# EAGLE schematic mainboard-revb (EAGLE 9.6.2)

## Sheet 1 of 11: USB-C Contains input power port and PHY
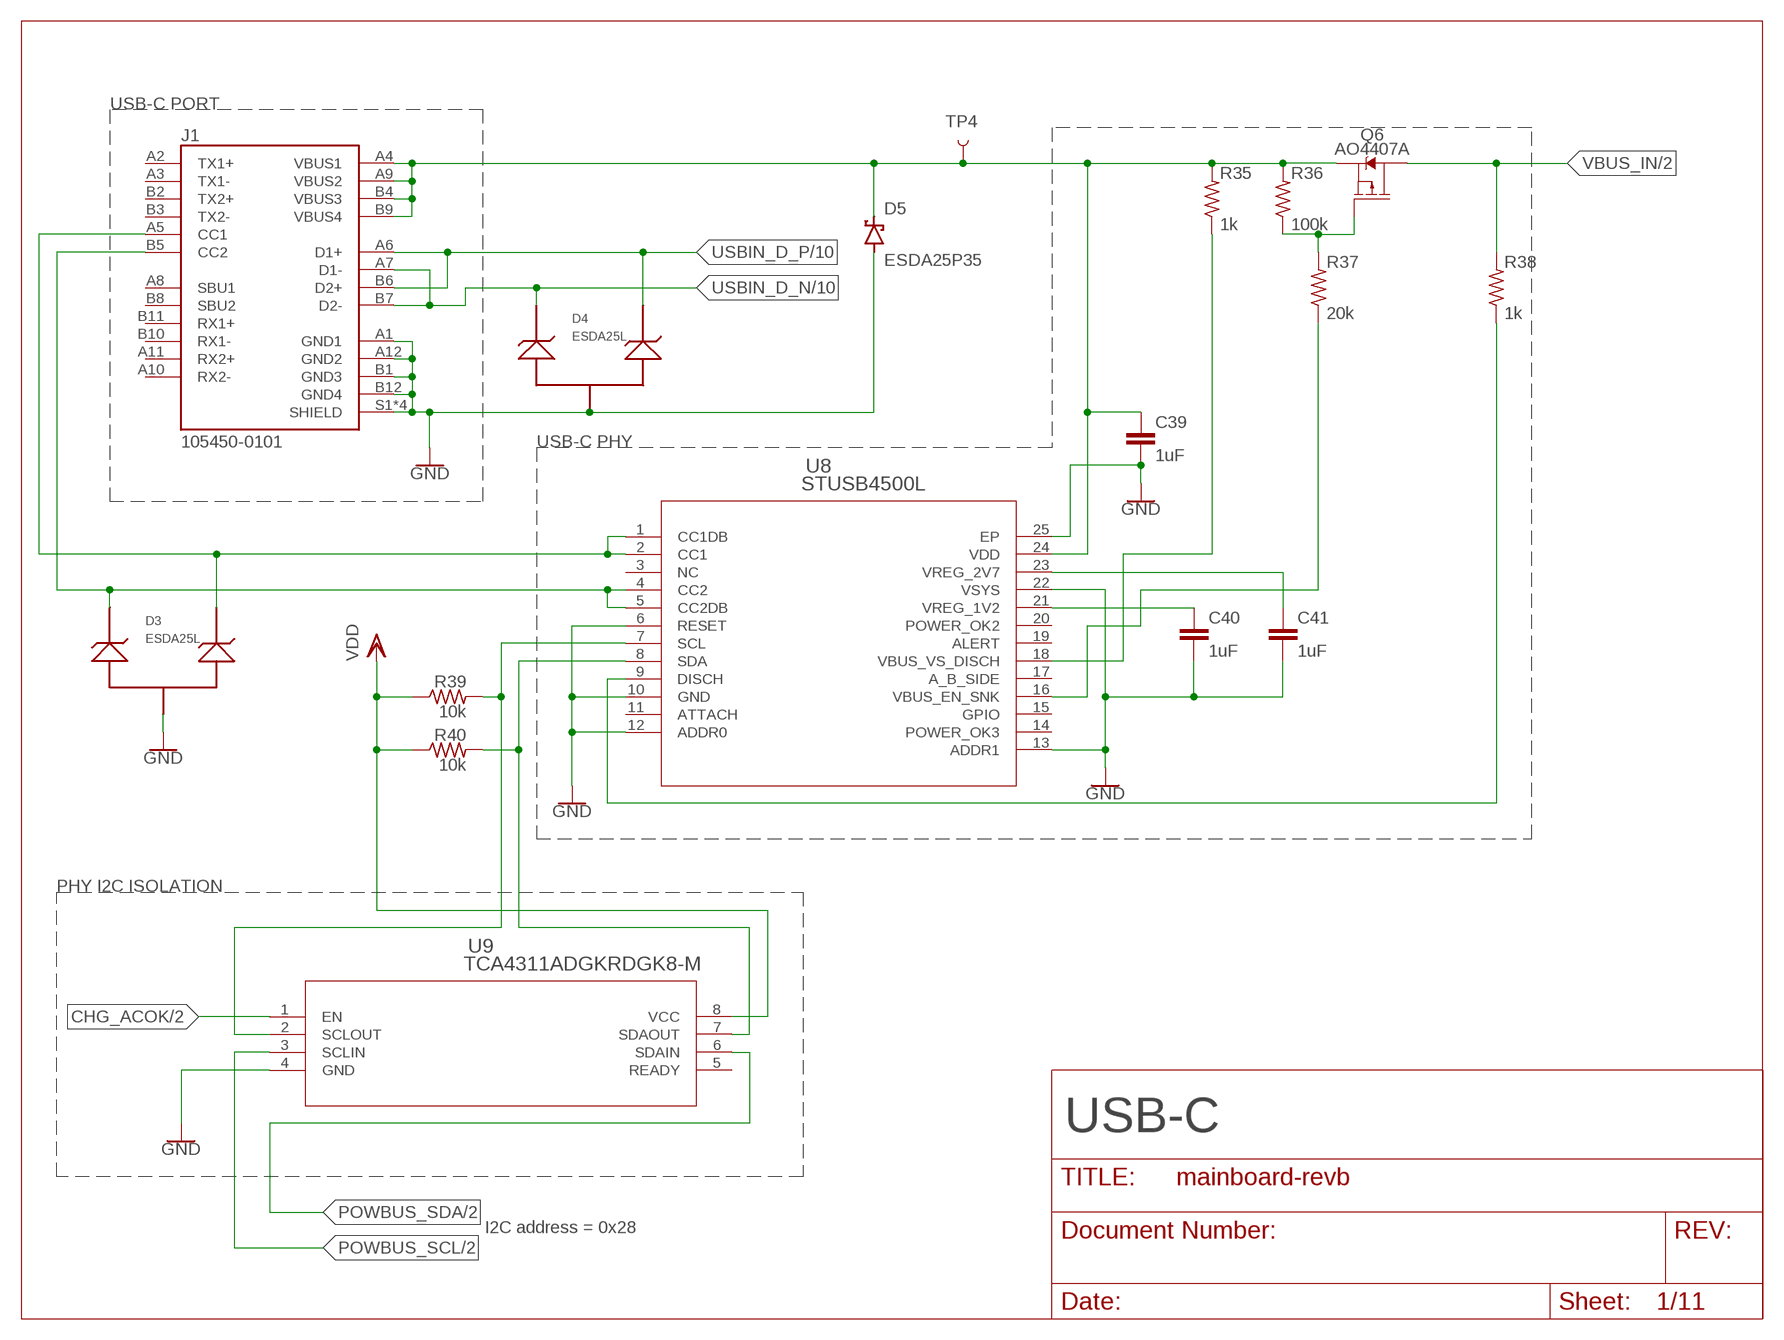
[diagram p0: schematic, sheet 1]

### Parts
C39  1uF  C-EUC0805  [C0805]
C40  1uF  C-EUC0805  [C0805]
C41  1uF  C-EUC0805  [C0805]
D3  ESDA25L  ESDAL  [SOT85P255X140-3L]
D4  ESDA25L  ESDAL  [SOT85P255X140-3L]
D5  ESDA25P35  SMF5.0AT1  [SOD123FL]
J1  105450-0101  [MOLEX_105450-0101]
Q6  AO4407A  [SOIC8]
R35  1k  R-US_R0402  [R0402]
R36  100k  R-US_R0402  [R0402]
R37  20k  R-US_R0402  [R0402]
R38  1k  R-US_R0402  [R0402]
R39  10k  R-US_R0402  [R0402]
R40  10k  R-US_R0402  [R0402]
TP4  TEST-POINT3X4  [PAD.03X.04]
U8  STUSB4500L  STUSB4500QTRQFN24EP_4X4_STM-M  [QFN24EP_4X4_STM-M]
U9  TCA4311ADGKRDGK8-M  [DGK8-M]

### Nets
CHG_ACOK: U9.1(EN) ; also sheet 2,10
GND: C39.2 C40.2 C41.2 D3.3 D4.3 D5.A J1.A1(GND1) J1.A12(GND2) J1.B1(GND3) J1.B12(GND4) J1.S1(SHIELD) J1.S2(SHIELD) J1.S3(SHIELD) J1.S4(SHIELD) U8.6(RESET) U8.10(GND) U8.12(ADDR0) U8.13(ADDR1) U8.22(VSYS) U8.25(EP) U9.4(GND) ; also sheet 2,3,4,6,7,8,9,10,11
N$27: C40.1 U8.21(VREG_1V2)
N$28: C41.1 U8.23(VREG_2V7)
N$32: C39.1 D5.C J1.A4(VBUS1) J1.A9(VBUS2) J1.B4(VBUS3) J1.B9(VBUS4) Q6.1(S) Q6.2(S) Q6.3(S) R35.2 R36.2 TP4.P$1 U8.24(VDD)
N$33: R35.1 U8.18(VBUS_VS_DISCH)
N$34: R37.1 U8.16(VBUS_EN_SNK)
N$35: Q6.4(G) R36.1 R37.2
N$37: R38.1 U8.9(DISCH)
N$38: R39.2 U8.7(SCL) U9.2(SCLOUT)
N$39: R40.2 U8.8(SDA) U9.7(SDAOUT)
POWBUS_SCL: U9.3(SCLIN) ; also sheet 2,3,9,10
POWBUS_SDA: U9.6(SDAIN) ; also sheet 2,3,9,10
USBIN_CC1: D3.2 J1.A5(CC1) U8.1(CC1DB) U8.2(CC1)
USBIN_CC2: D3.1 J1.B5(CC2) U8.4(CC2) U8.5(CC2DB)
USBIN_D_N: D4.1 J1.A7(D1-) J1.B7(D2-) ; also sheet 10
USBIN_D_P: D4.2 J1.A6(D1+) J1.B6(D2+) ; also sheet 10
VBUS_IN: Q6.5(D) Q6.6(D) Q6.7(D) Q6.8(D) R38.2 ; also sheet 2
VDD: R39.1 R40.1 U9.8(VCC) ; also sheet 2,3,4,5,6,7,8,9,10,11
Unconnected: J1.A2(TX1+) J1.A3(TX1-) J1.A8(SBU1) J1.A10(RX2-) J1.A11(RX2+) J1.B2(TX2+) J1.B3(TX2-) J1.B8(SBU2) J1.B10(RX1-) J1.B11(RX1+) U8.3(NC) U8.11(ATTACH) U8.14(POWER_OK3) U8.15(GPIO) U8.17(A_B_SIDE) U8.19(ALERT) U8.20(POWER_OK2) U9.5(READY)

### Notes on the sheet
- USB-C PORT
- USB-C PHY
- PHY I2C ISOLATION
- USB-C
- I2C address = 0x28

## Sheet 2 of 11: Battery Management (1/2) Contains the battery charger
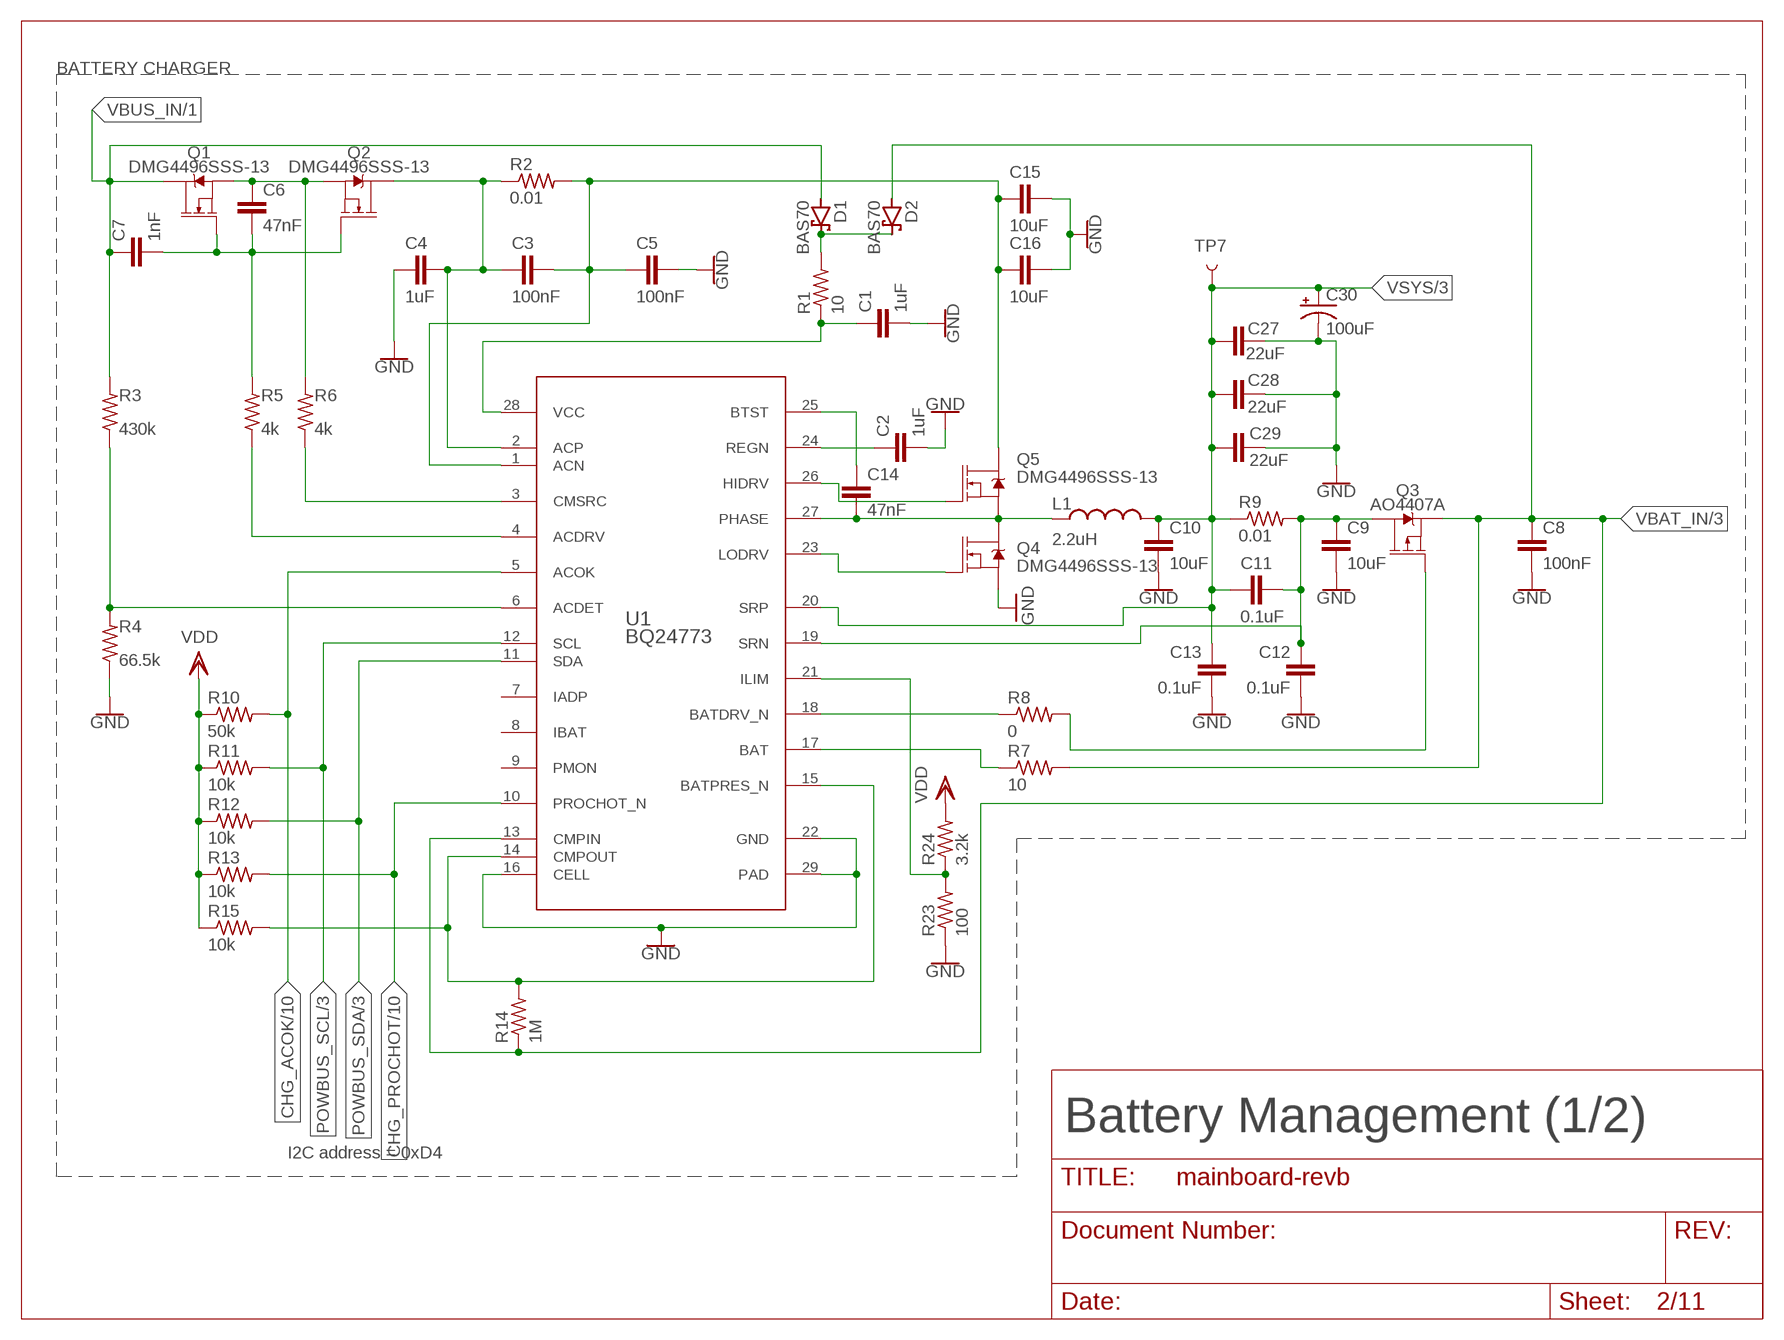
[diagram p1: schematic, sheet 2]

### Parts
C1  1uF  C-EUC0402  [C0402]
C2  1uF  C-EUC0402  [C0402]
C3  100nF  C-EUC0402  [C0402]
C4  1uF  C-EUC0402  [C0402]
C5  100nF  C-EUC0402  [C0402]
C6  47nF  C-EUC0402  [C0402]
C7  1nF  C-EUC0402  [C0402]
C8  100nF  C-EUC0402  [C0402]
C9  10uF  C-EUC0402  [C0402]
C10  10uF  C-EUC0402  [C0402]
C11  0.1uF  C-EUC0402  [C0402]
C12  0.1uF  C-EUC0402  [C0402]
C13  0.1uF  C-EUC0402  [C0402]
C14  47nF  C-EUC0402  [C0402]
C15  10uF  C-EUC0402  [C0402]
C16  10uF  C-EUC0402  [C0402]
C27  22uF  C-EUC0402  [C0402]
C28  22uF  C-EUC0402  [C0402]
C29  22uF  C-EUC0402  [C0402]
C30  100uF  CPOL-USC/6032-28R  [C/6032-28R]
D1  BAS70  [SOT23]
D2  BAS70  [SOT23]
L1  2.2uH  SPM6530T-2R2M  [INDPM7165X300N]
Q1  DMG4496SSS-13  [SOIC8]
Q2  DMG4496SSS-13  [SOIC8]
Q3  AO4407A  [SOIC8]
Q4  DMG4496SSS-13  [SOIC8]
Q5  DMG4496SSS-13  [SOIC8]
R1  10  R-US_R0402  [R0402]
R2  0.01  R-US_R0402  [R0402]
R3  430k  R-US_R0402  [R0402]
R4  66.5k  R-US_R0402  [R0402]
R5  4k  R-US_R0402  [R0402]
R6  4k  R-US_R0402  [R0402]
R7  10  R-US_R0402  [R0402]
R8  0  R-US_R0402  [R0402]
R9  0.01  R-US_R0402  [R0402]
R10  50k  R-US_R0402  [R0402]
R11  10k  R-US_R0402  [R0402]
R12  10k  R-US_R0402  [R0402]
R13  10k  R-US_R0402  [R0402]
R14  1M  R-US_R0402  [R0402]
R15  10k  R-US_R0402  [R0402]
R23  100  R-US_R0402  [R0402]
R24  3.2k  R-US_R0402  [R0402]
TP7  TEST-POINT3X4  [PAD.03X.04]
U1  Value  BQ24773RUYR  [RUY0028A]

### Nets
CHG_ACOK: R10.2 U1.5(ACOK) ; also sheet 1,10
CHG_PROCHOT: R13.2 U1.10(PROCHOT_N) ; also sheet 10
GND: C1.2 C2.2 C4.1 C5.2 C8.2 C9.2 C10.2 C12.1 C13.1 C15.1 C16.1 C27.1 C28.1 C29.1 C30.- Q4.1(S) Q4.2(S) Q4.3(S) R4.1 R23.1 U1.16(CELL) U1.22(GND) U1.29(PAD) ; also sheet 1,3,4,6,7,8,9,10,11
N$1: C3.1 C4.2 Q2.5(D) Q2.6(D) Q2.7(D) Q2.8(D) R2.1 U1.2(ACP)
N$2: C3.2 C5.1 C15.2 C16.2 Q5.5(D) Q5.6(D) Q5.7(D) Q5.8(D) R2.2 U1.1(ACN)
N$3: R7.1 U1.17(BAT)
N$4: D1.3(C) D2.3(C) R1.2
N$5: C6.1 Q1.1(S) Q1.2(S) Q1.3(S) Q2.1(S) Q2.2(S) Q2.3(S) R6.2
N$6: R6.1 U1.3(CMSRC)
N$7: R5.1 U1.4(ACDRV)
N$8: R3.1 R4.2 U1.6(ACDET)
N$9: C6.2 C7.2 Q1.4(G) Q2.4(G) R5.2
N$10: C1.1 R1.1 U1.28(VCC)
N$11: Q3.4(G) R8.2
N$12: R8.1 U1.18(BATDRV_N)
N$13: C9.1 C11.2 C12.2 Q3.5(D) Q3.6(D) Q3.7(D) Q3.8(D) R9.2 U1.19(SRN)
N$14: C2.1 U1.24(REGN)
N$15: C14.2 U1.25(BTST)
N$16: C14.1 L1.1 Q4.5(D) Q4.6(D) Q4.7(D) Q4.8(D) Q5.1(S) Q5.2(S) Q5.3(S) U1.27(PHASE)
N$17: Q4.4(G) U1.23(LODRV)
N$18: Q5.4(G) U1.26(HIDRV)
N$20: R14.2 R15.2 U1.14(CMPOUT) U1.15(BATPRES_N)
N$31: R23.2 R24.1 U1.21(ILIM)
POWBUS_SCL: R11.2 U1.12(SCL) ; also sheet 1,3,9,10
POWBUS_SDA: R12.2 U1.11(SDA) ; also sheet 1,3,9,10
VBAT_IN: C8.1 D2.1(A) Q3.1(S) Q3.2(S) Q3.3(S) R7.2 R14.1 U1.13(CMPIN) ; also sheet 3
VBUS_IN: C7.1 D1.1(A) Q1.5(D) Q1.6(D) Q1.7(D) Q1.8(D) R3.2 ; also sheet 1
VDD: R10.1 R11.1 R12.1 R13.1 R15.1 R24.2 ; also sheet 1,3,4,5,6,7,8,9,10,11
VSYS: C10.1 C11.1 C13.2 C27.2 C28.2 C29.2 C30.+ L1.2 R9.1 TP7.P$1 U1.20(SRP) ; also sheet 3,4
Unconnected: U1.7(IADP) U1.8(IBAT) U1.9(PMON)

### Notes on the sheet
- BATTERY CHARGER
- Battery Management (1/2)
- I2C address = 0xD4

## Sheet 3 of 11: Battery Management (2/2) Contains the battery gauge and connector NOTE: the calibration info is provided for reference only and is in no way present on the pcb
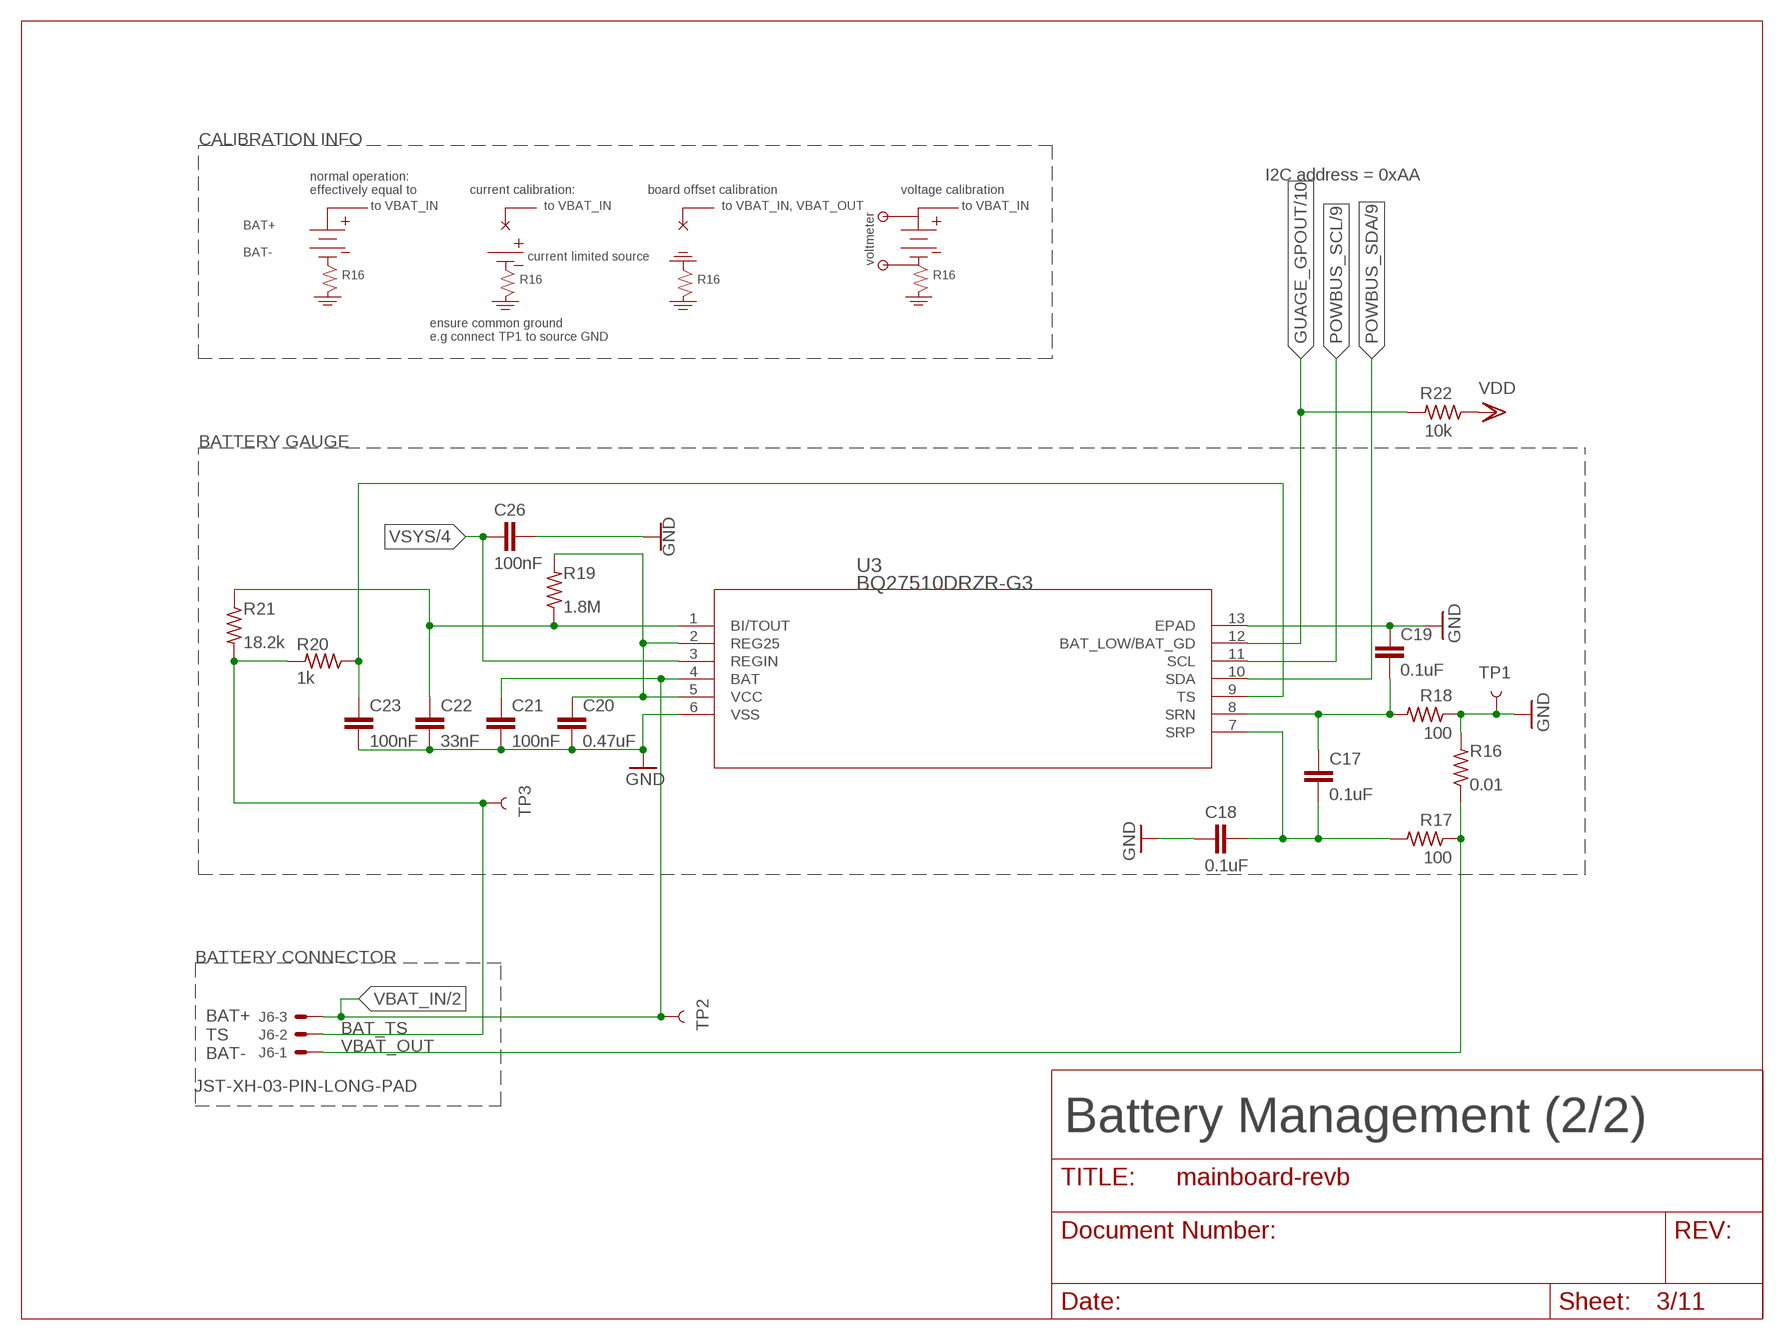
[diagram p2: schematic, sheet 3]

### Parts
C17  0.1uF  C-EUC0402  [C0402]
C18  0.1uF  C-EUC0402  [C0402]
C19  0.1uF  C-EUC0402  [C0402]
C20  0.47uF  C-EUC0402  [C0402]
C21  100nF  C-EUC0402  [C0402]
C22  33nF  C-EUC0402  [C0402]
C23  100nF  C-EUC0402  [C0402]
C26  100nF  C-EUC0402  [C0402]
J6  JST-XH-03-PIN-LONG-PAD  [JST-XH-03-PACKAGE-LONG-PAD]
R16  0.01  R-US_R0402  [R0402]
R17  100  R-US_R0402  [R0402]
R18  100  R-US_R0402  [R0402]
R19  1.8M  R-US_R0402  [R0402]
R20  1k  R-US_R0402  [R0402]
R21  18.2k  R-US_R0402  [R0402]
R22  10k  R-US_R0402  [R0402]
TP1  TEST-POINT3X4  [PAD.03X.04]
TP2  TEST-POINT3X4  [PAD.03X.04]
TP3  TEST-POINT3X4  [PAD.03X.04]
U3  BQ27510DRZR-G3  [DRZ12_1P95X2P45_TEX]

### Nets
BAT_TS: J6.2 R20.2 R21.2 TP3.P$1
GND: C18.1 C19.1 C20.2 C21.2 C22.2 C23.2 C26.2 R16.2 R18.1 TP1.P$1 U3.6(VSS) U3.13(EPAD) ; also sheet 1,2,4,6,7,8,9,10,11
GUAGE_GPOUT: R22.2 U3.12(BAT_LOW/BAT_GD) ; also sheet 10
N$21: C17.2 C18.2 R17.2 U3.7(SRP)
N$22: C17.1 C19.2 R18.2 U3.8(SRN)
N$23: C22.1 R19.1 R21.1 U3.1(BI/TOUT)
N$24: C20.1 R19.2 U3.2(REG25) U3.5(VCC)
N$26: C23.1 R20.1 U3.9(TS)
POWBUS_SCL: U3.11(SCL) ; also sheet 1,2,9,10
POWBUS_SDA: U3.10(SDA) ; also sheet 1,2,9,10
VBAT_IN: C21.1 J6.3 TP2.P$1 U3.4(BAT) ; also sheet 2
VBAT_OUT: J6.1 R16.1 R17.1
VDD: R22.1 ; also sheet 1,2,4,5,6,7,8,9,10,11
VSYS: C26.1 U3.3(REGIN) ; also sheet 2,4

### Notes on the sheet
- CALIBRATION INFO
- I2C address = 0xAA
- normal operation:
  effectively equal to
- current calibration: | board offset calibration | voltage calibration
- to VBAT_IN | to VBAT_IN | to VBAT_IN, VBAT_OUT | to VBAT_IN
- BAT+
  
  BAT-
- current limited source
- voltmeter
- R16 | R16
- R16 | R16
- ensure common ground
  e.g connect TP1 to source GND
- BATTERY GAUGE
- BATTERY CONNECTOR
- BAT+
  TS
  BAT-
- Battery Management (2/2)

## Sheet 4 of 11: Voltage Regulators/Switches Contains all regulators for generating the various power rails onboard
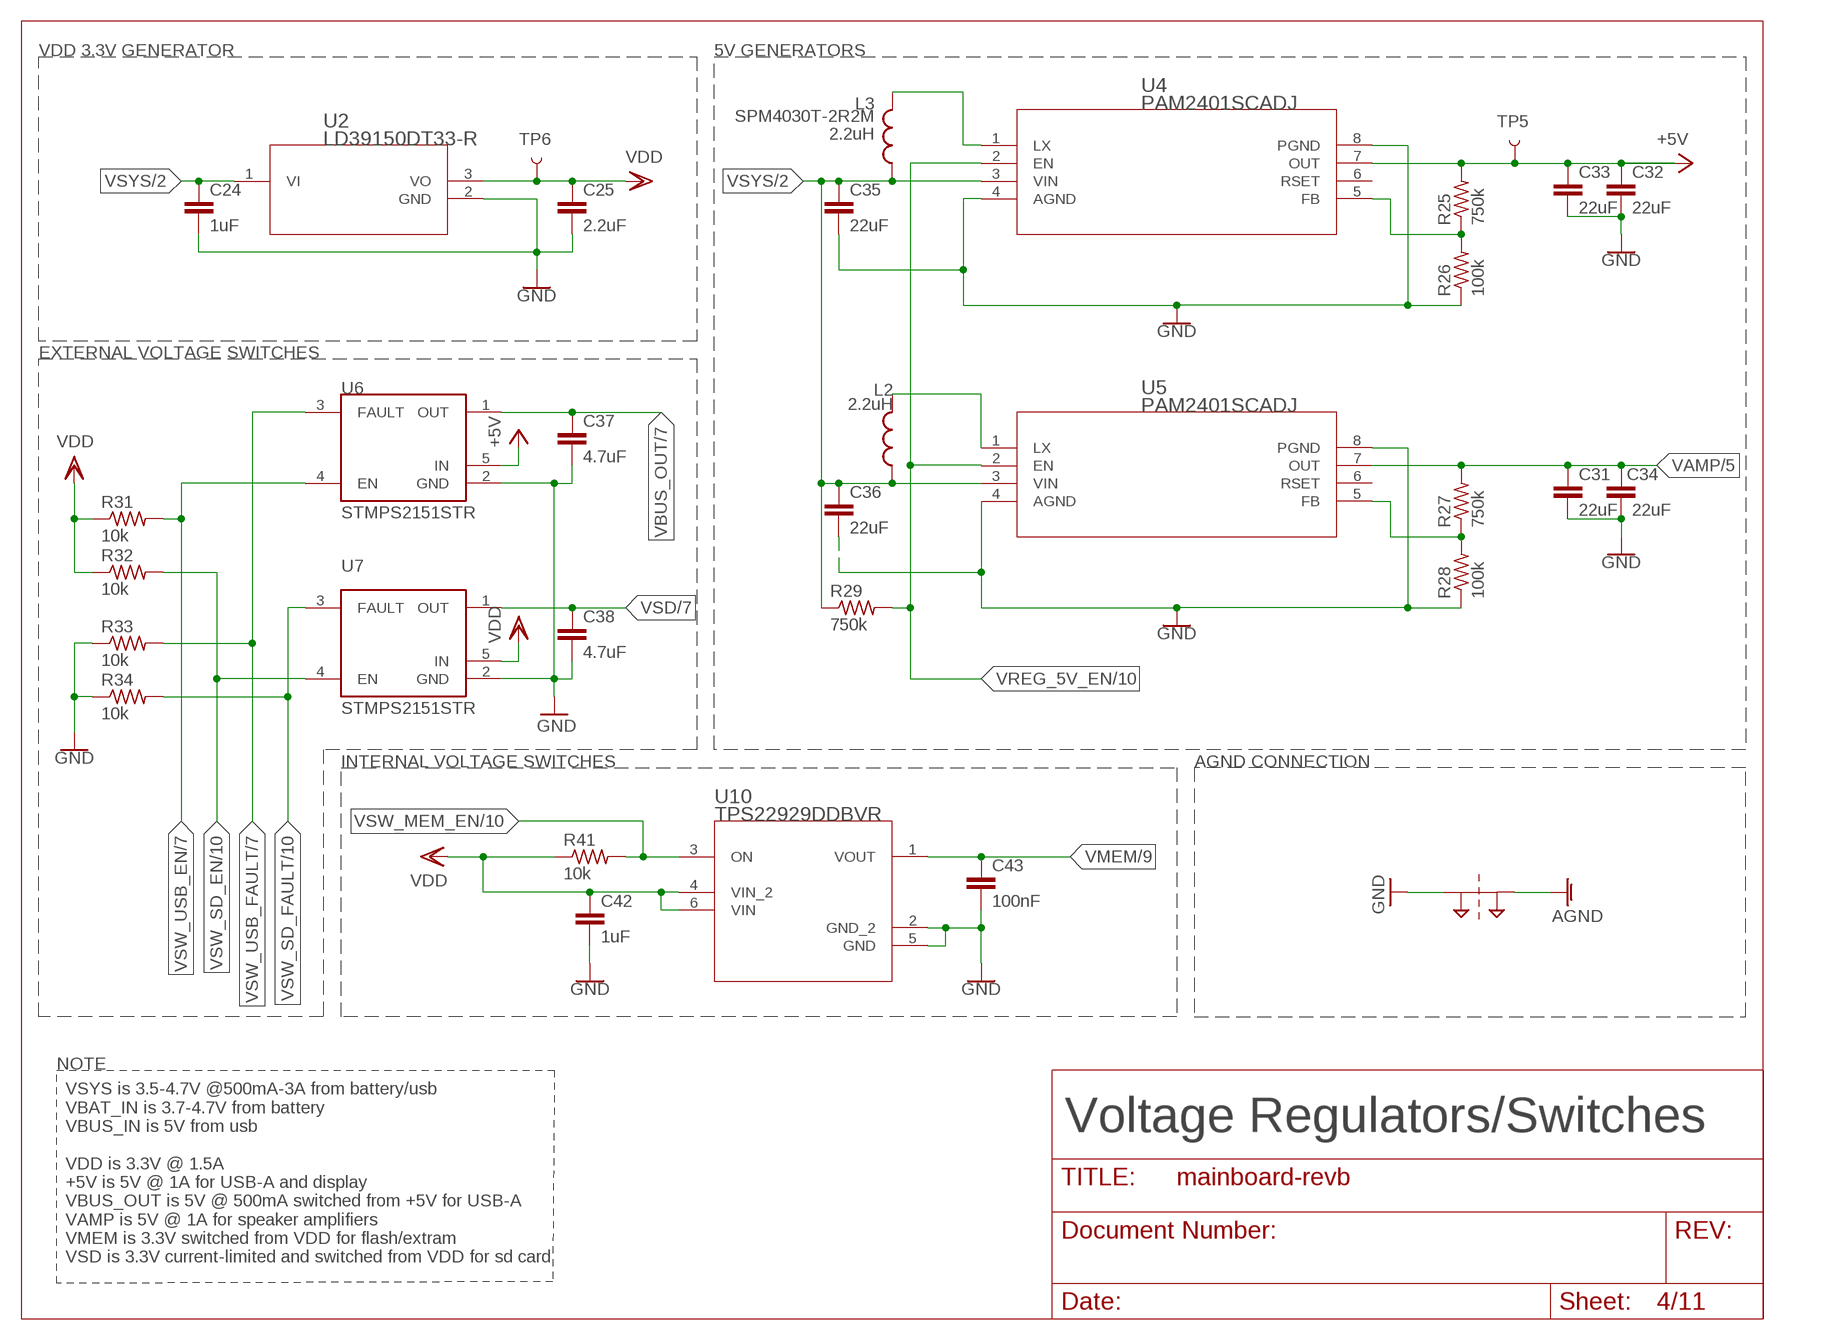
[diagram p3: schematic, sheet 4]

### Parts
C24  1uF  C-EUC0402  [C0402]
C25  2.2uF  C-EUC0402  [C0402]
C31  22uF  C-EUC0402  [C0402]
C32  22uF  C-EUC0402  [C0402]
C33  22uF  C-EUC0402  [C0402]
C34  22uF  C-EUC0402  [C0402]
C35  22uF  C-EUC0402  [C0402]
C36  22uF  C-EUC0402  [C0402]
C37  4.7uF  C-EUC0402  [C0402]
C38  4.7uF  C-EUC0402  [C0402]
C42  1uF  C-EUC0402  [C0402]
C43  100nF  C-EUC0402  [C0402]
L2  2.2uH  L_MOLDED-1612(4030-METRIC)  [INDM4030X267]
L3  2.2uH  L_MOLDED-1612(4030-METRIC)  [INDM4030X267]
R25  750k  R-US_R0805  [R0805]
R26  100k  R-US_R0805  [R0805]
R27  750k  R-US_R0805  [R0805]
R28  100k  R-US_R0805  [R0805]
R29  750k  R-US_R0805  [R0805]
R31  10k  R-US_R0805  [R0805]
R32  10k  R-US_R0805  [R0805]
R33  10k  R-US_R0805  [R0805]
R34  10k  R-US_R0805  [R0805]
R41  10k  R-US_R0805  [R0805]
SUPPLY1  2PT_GND_TIE  [2PT_GND_TIE]
TP5  TEST-POINT3X4  [PAD.03X.04]
TP6  TEST-POINT3X4  [PAD.03X.04]
U2  LD39150DT33-R  [SOT_0DT33-R_STM]
U4  PAM2401SCADJ  [MSOP8_DIO]
U5  PAM2401SCADJ  [MSOP8_DIO]
U6  STMPS2151STR  [SOT23-5L]
U7  STMPS2151STR  [SOT23-5L]
U10  TPS22929DDBVR  [DBV6]

### Nets
+5V: C32.1 C33.1 R25.2 TP5.P$1 U4.7(OUT) U6.5(IN) ; also sheet 6,7
AGND: SUPPLY1.P$2 ; also sheet 5
GND: C24.2 C25.2 C31.2 C32.2 C33.2 C34.2 C35.2 C36.2 C37.2 C38.2 C42.2 C43.2 R26.1 R28.1 R33.1 R34.1 SUPPLY1.P$1 U2.2(GND) U4.4(AGND) U4.8(PGND) U5.4(AGND) U5.8(PGND) U6.2(GND) U7.2(GND) U10.2(GND_2) U10.5(GND) ; also sheet 1,2,3,6,7,8,9,10,11
N$19: L3.2 U4.1(LX)
N$25: L2.2 U5.1(LX)
N$29: R25.1 R26.2 U4.5(FB)
N$30: R27.1 R28.2 U5.5(FB)
VAMP: C31.1 C34.1 R27.2 U5.7(OUT) ; also sheet 5
VBUS_OUT: C37.1 U6.1(OUT) ; also sheet 7
VDD: C25.1 C42.1 R31.1 R32.1 R41.1 TP6.P$1 U2.3(VO) U7.5(IN) U10.4(VIN_2) U10.6(VIN) ; also sheet 1,2,3,5,6,7,8,9,10,11
VMEM: C43.1 U10.1(VOUT) ; also sheet 9
VREG_5V_EN: R29.2 U4.2(EN) U5.2(EN) ; also sheet 10
VSD: C38.1 U7.1(OUT) ; also sheet 7
VSW_MEM_EN: R41.2 U10.3(ON) ; also sheet 10
VSW_SD_EN: R32.2 U7.4(EN) ; also sheet 10
VSW_SD_FAULT: R34.2 U7.3(FAULT) ; also sheet 10
VSW_USB_EN: R31.2 U6.4(EN) ; also sheet 7
VSW_USB_FAULT: R33.2 U6.3(FAULT) ; also sheet 7
VSYS: C24.1 C35.1 C36.1 L2.1 L3.1 R29.1 U2.1(VI) U4.3(VIN) U5.3(VIN) ; also sheet 2,3
Unconnected: U4.6(RSET) U5.6(RSET)

### Notes on the sheet
- VDD 3.3V GENERATOR | 5V GENERATORS
- EXTERNAL VOLTAGE SWITCHES
- INTERNAL VOLTAGE SWITCHES | AGND CONNECTION
- NOTE
- Voltage Regulators/Switches
- VSYS is 3.5-4.7V @500mA-3A from battery/usb
  VBAT_IN is 3.7-4.7V from battery
  VBUS_IN is 5V from usb
  
  VDD is 3.3V @ 1.5A
  +5V is 5V @ 1A for USB-A and display
  VBUS_OUT is 5V @ 500mA switched from +5V for USB-A
  VAMP is 5V @ 1A for speaker amplifiers
  VMEM is 3.3V switched from VDD for flash/extram
  VSD is 3.3V current-limited and switched from VDD for sd card

## Sheet 5 of 11: Analog Audio Contains all of the amplifiers, supporting circuitry and DAC for generating the headphone and speaker signals
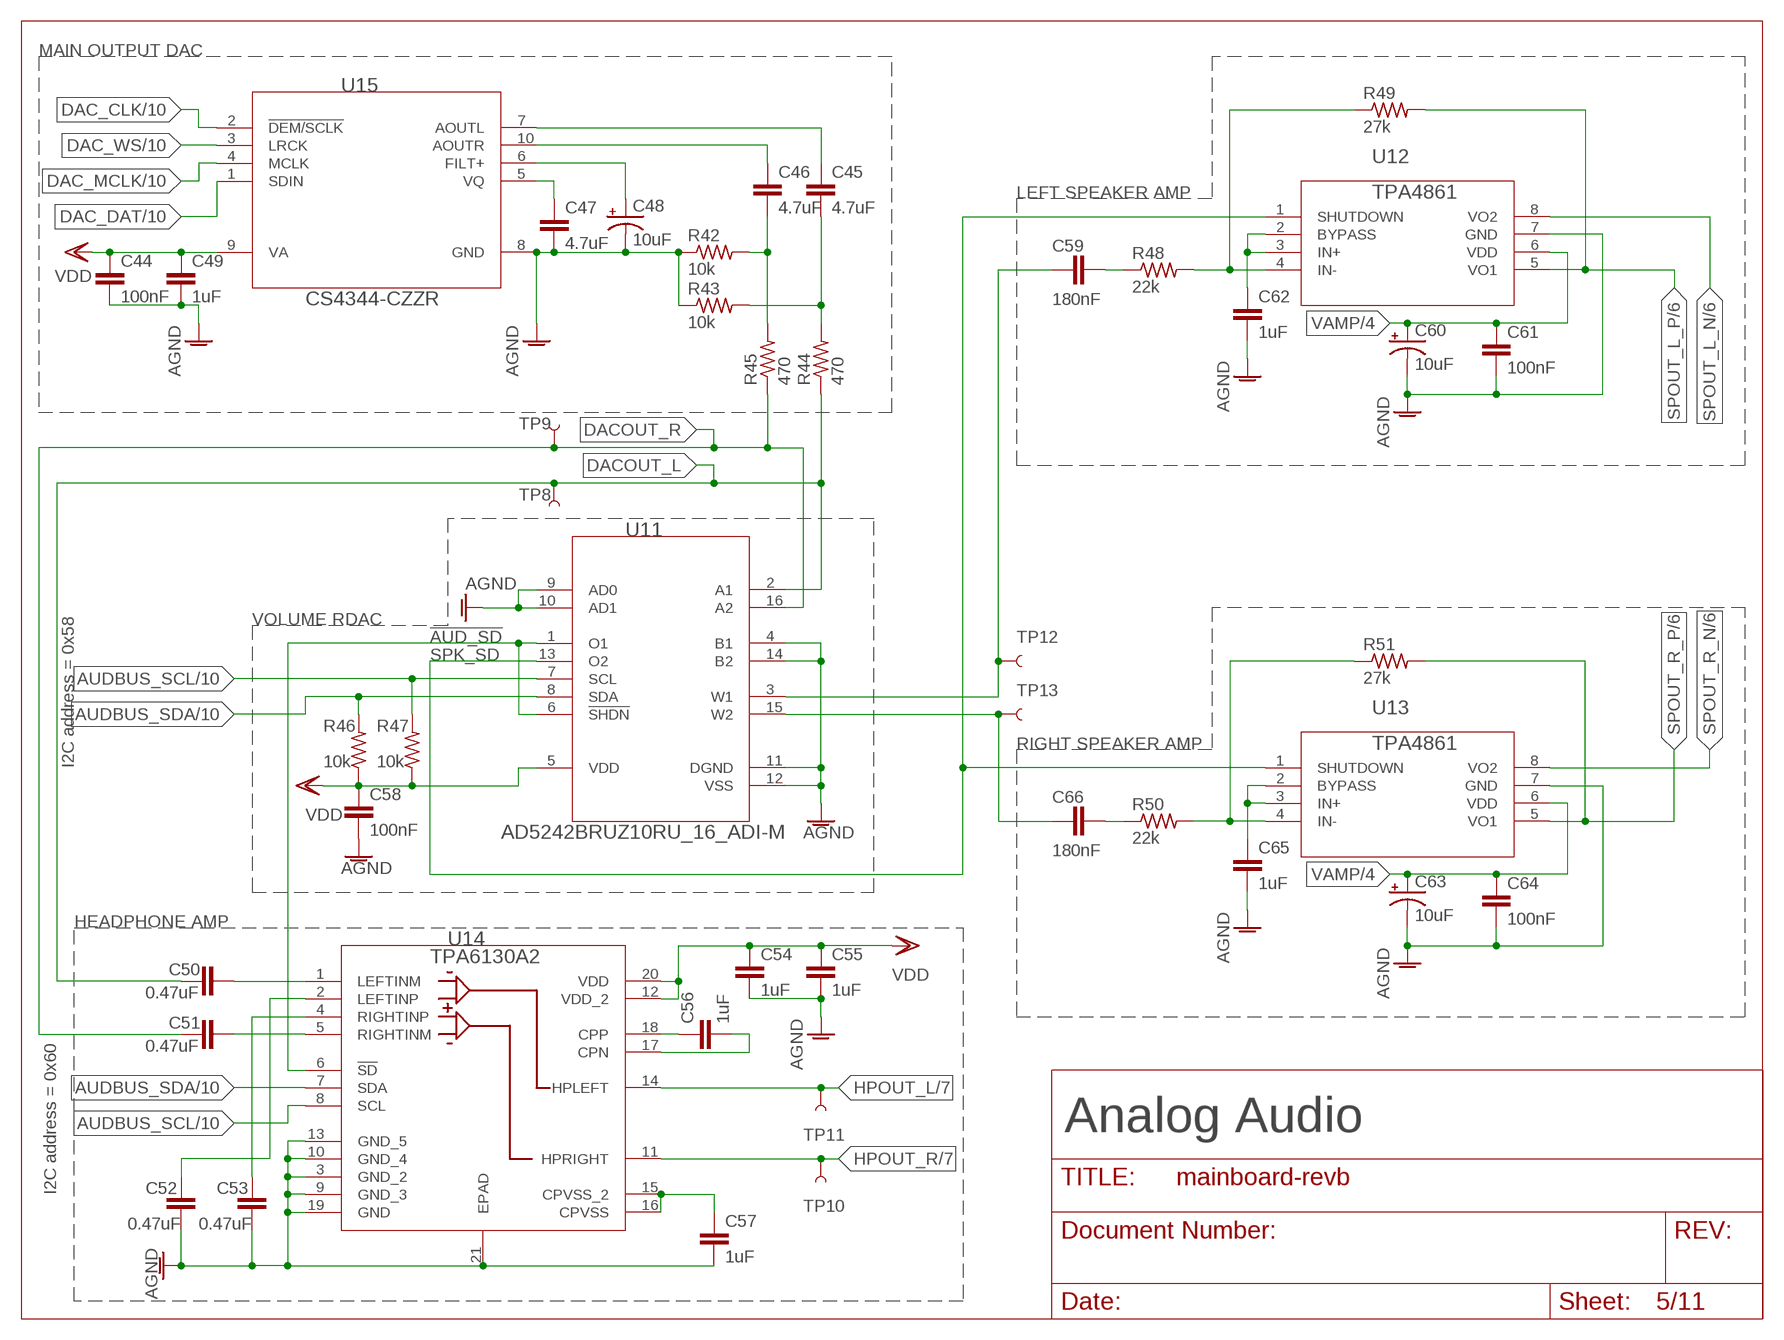
[diagram p4: schematic, sheet 5]

### Parts
C44  100nF  C-EUC0504  [C0504]
C45  4.7uF  C-EUC0504  [C0504]
C46  4.7uF  C-EUC0504  [C0504]
C47  4.7uF  C-EUC0504  [C0504]
C48  10uF  CPOL-USSMCC  [SMC_C]
C49  1uF  C-EUC0504  [C0504]
C50  0.47uF  C-EUC0504  [C0504]
C51  0.47uF  C-EUC0504  [C0504]
C52  0.47uF  C-EUC0504  [C0504]
C53  0.47uF  C-EUC0504  [C0504]
C54  1uF  C-EUC0504  [C0504]
C55  1uF  C-EUC0504  [C0504]
C56  1uF  C-EUC0504  [C0504]
C57  1uF  C-EUC0504  [C0504]
C58  100nF  C-EUC0504  [C0504]
C59  180nF  C-EUC0504  [C0504]
C60  10uF  CPOL-USSMCC  [SMC_C]
C61  100nF  C-EUC0504  [C0504]
C62  1uF  C-EUC0504  [C0504]
C63  10uF  CPOL-USSMCC  [SMC_C]
C64  100nF  C-EUC0504  [C0504]
C65  1uF  C-EUC0504  [C0504]
C66  180nF  C-EUC0504  [C0504]
R42  10k  R-US_R0603  [R0603]
R43  10k  R-US_R0603  [R0603]
R44  470  R-US_R0603  [R0603]
R45  470  R-US_R0603  [R0603]
R46  10k  R-US_R0603  [R0603]
R47  10k  R-US_R0603  [R0603]
R48  22k  R-US_R0603  [R0603]
R49  27k  R-US_R0603  [R0603]
R50  22k  R-US_R0603  [R0603]
R51  27k  R-US_R0603  [R0603]
TP8  TEST-POINT3X4  [PAD.03X.04]
TP9  TEST-POINT3X4  [PAD.03X.04]
TP10  TEST-POINT3X4  [PAD.03X.04]
TP11  TEST-POINT3X4  [PAD.03X.04]
TP12  TEST-POINT3X4  [PAD.03X.04]
TP13  TEST-POINT3X4  [PAD.03X.04]
U11  AD5242BRUZ10RU_16_ADI-M  [RU_16_ADI-M]
U12  TPA4861DRD8_TEX-M  [D8_TEX-M]
U13  TPA4861DRD8_TEX-M  [D8_TEX-M]
U14  TPA6130A2RTJR  [RTJ20_2P7X2P7]
U15  CS4344-CZZR  [CIR_3TSSOP-10]

### Nets
!AUD_SD: U11.1(O1) U11.6(!SHDN) U14.6(!SD)
AGND: C44.2 C47.1 C48.- C49.2 C52.1 C53.1 C54.2 C55.2 C57.2 C58.2 C60.- C61.2 C62.2 C63.- C64.2 C65.2 R42.1 R43.1 U11.4(B1) U11.9(AD0) U11.10(AD1) U11.11(DGND) U11.12(VSS) U11.14(B2) U12.7(GND) U13.7(GND) U14.3(GND_2) U14.9(GND_3) U14.10(GND_4) U14.13(GND_5) U14.19(GND) U14.21(EPAD) U15.8(GND) ; also sheet 4
AUDBUS_SCL: R47.2 U11.7(SCL) U14.8(SCL) ; also sheet 10
AUDBUS_SDA: R46.2 U11.8(SDA) U14.7(SDA) ; also sheet 10
DAC_CLK: U15.2(!DEM/SCLK) ; also sheet 10
DAC_DAT: U15.1(SDIN) ; also sheet 10
DAC_MCLK: U15.4(MCLK) ; also sheet 10
DAC_WS: U15.3(LRCK) ; also sheet 10
DACOUT_L: C50.1 R44.1 TP8.P$1 U11.2(A1)
DACOUT_R: C51.1 R45.1 TP9.P$1 U11.16(A2)
HPOUT_L: TP11.P$1 U14.14(HPLEFT) ; also sheet 7
HPOUT_R: TP10.P$1 U14.11(HPRIGHT) ; also sheet 7
N$36: C47.2 U15.5(VQ)
N$40: C48.+ U15.6(FILT+)
N$42: C46.1 U15.10(AOUTR)
N$43: C45.1 U15.7(AOUTL)
N$44: C45.2 R43.2 R44.2
N$45: C46.2 R42.2 R45.2
N$46: C57.1 U14.15(CPVSS_2) U14.16(CPVSS)
N$47: C50.2 U14.1(LEFTINM)
N$48: C51.2 U14.5(RIGHTINM)
N$49: C52.2 U14.2(LEFTINP)
N$50: C53.2 U14.4(RIGHTINP)
N$51: C62.1 U12.2(BYPASS) U12.3(IN+)
N$52: C56.2 U14.17(CPN)
N$53: C56.1 U14.18(CPP)
N$54: R48.2 R49.1 U12.4(IN-)
N$55: C59.2 R48.1
N$56: C65.1 U13.2(BYPASS) U13.3(IN+)
N$57: R50.2 R51.1 U13.4(IN-)
N$58: C66.2 R50.1
N$59: C59.1 TP12.P$1 U11.3(W1)
N$60: C66.1 TP13.P$1 U11.15(W2)
SPK_SD: U11.13(O2) U12.1(SHUTDOWN) U13.1(SHUTDOWN)
SPOUT_L_N: U12.8(VO2) ; also sheet 6
SPOUT_L_P: R49.2 U12.5(VO1) ; also sheet 6
SPOUT_R_N: U13.8(VO2) ; also sheet 6
SPOUT_R_P: R51.2 U13.5(VO1) ; also sheet 6
VAMP: C60.+ C61.1 C63.+ C64.1 U12.6(VDD) U13.6(VDD) ; also sheet 4
VDD: C44.1 C49.1 C54.1 C55.1 C58.1 R46.1 R47.1 U11.5(VDD) U14.12(VDD_2) U14.20(VDD) U15.9(VA) ; also sheet 1,2,3,4,6,7,8,9,10,11

### Notes on the sheet
- MAIN OUTPUT DAC
- LEFT SPEAKER AMP
- VOLUME RDAC
- RIGHT SPEAKER AMP
- I2C address = 0x58
- HEADPHONE AMP
- Analog Audio
- I2C address = 0x60

## Sheet 6 of 11: Internal Connectors and Reset
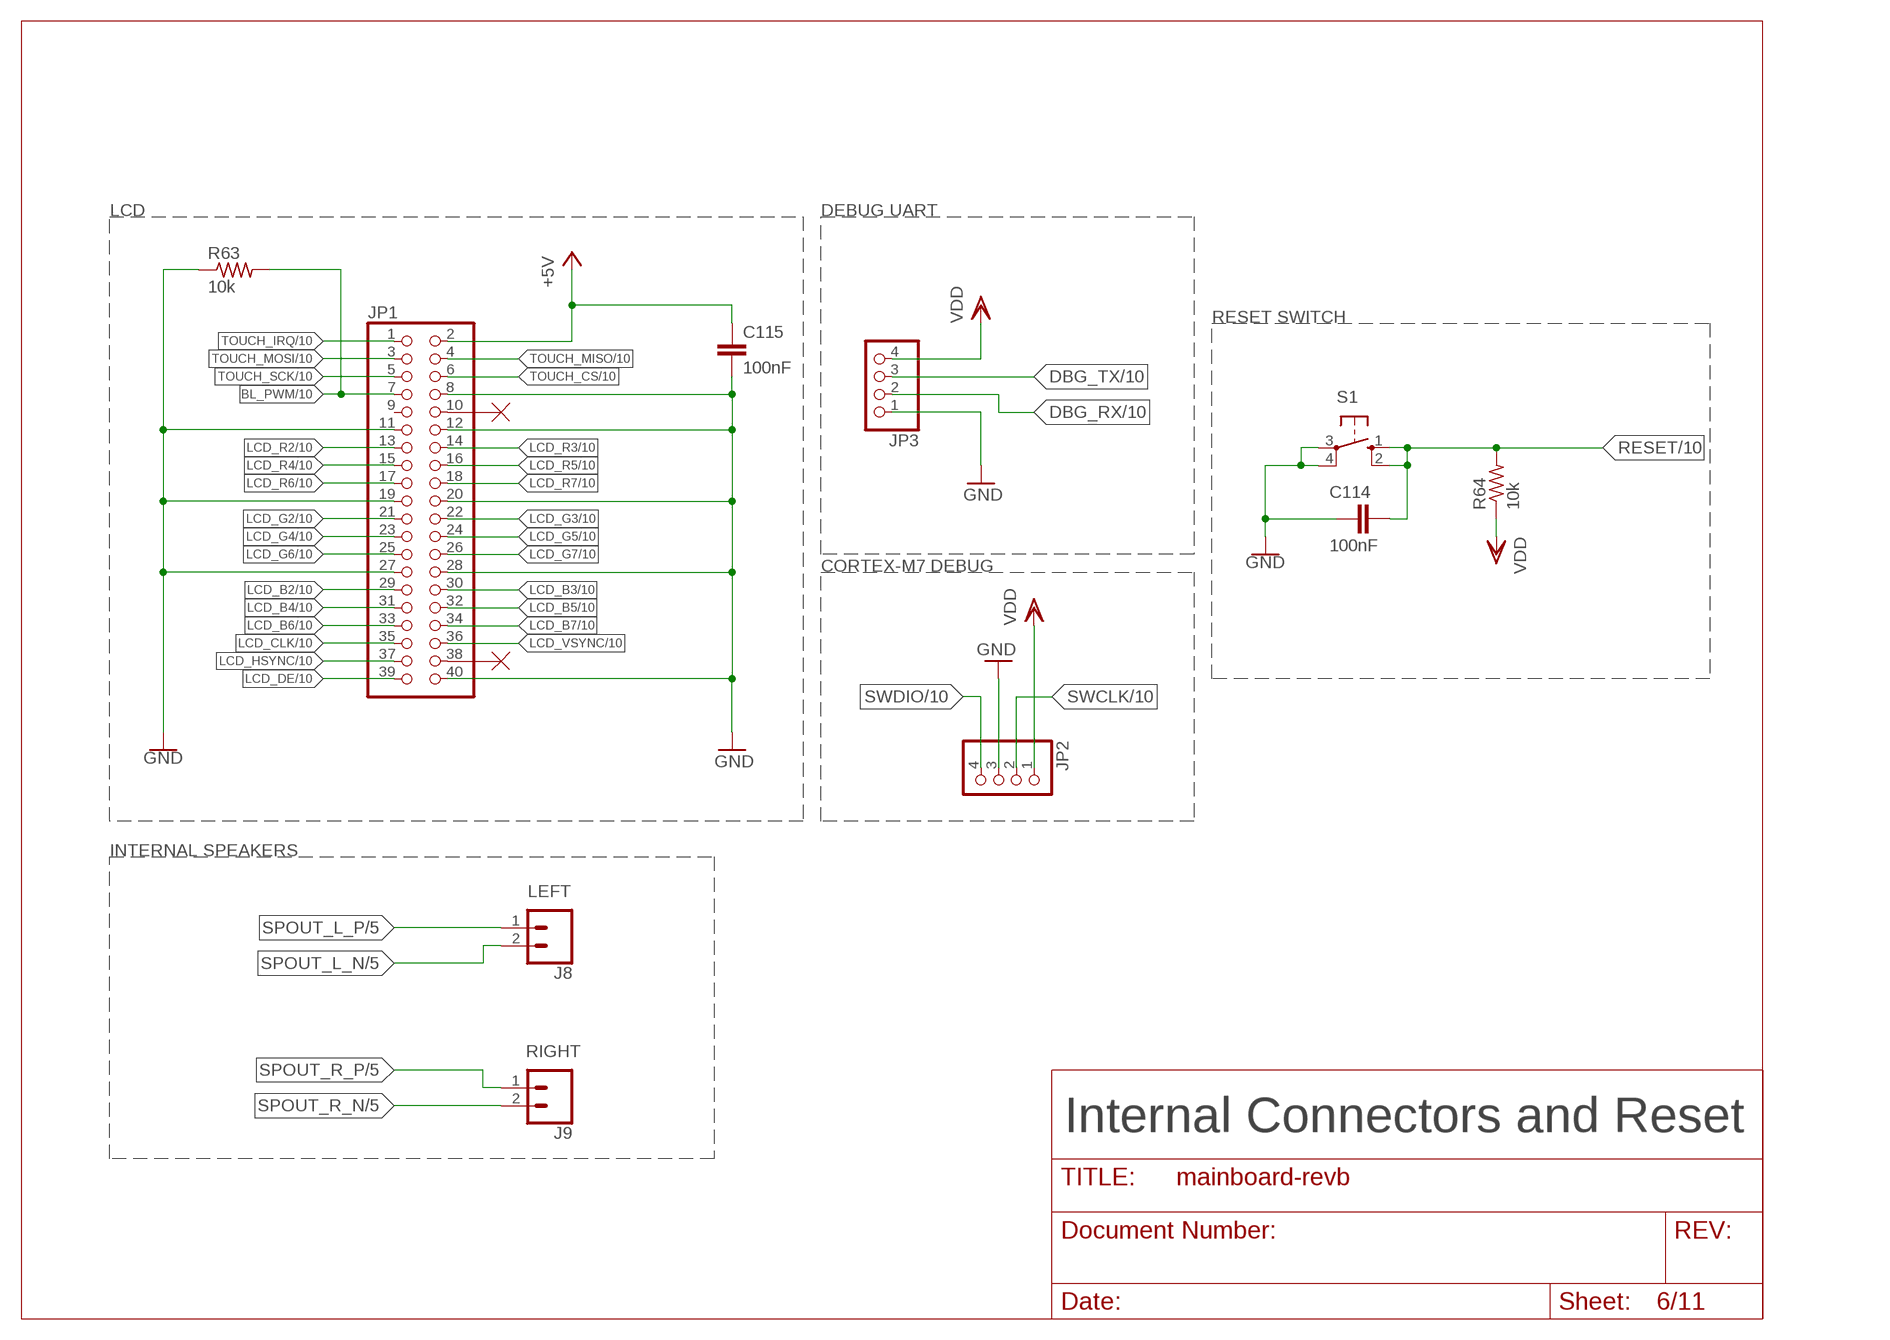
[diagram p5: schematic, sheet 6]

### Parts
C114  100nF  C-EUC0603  [C0603]
C115  100nF  C-EUC0603  [C0603]
J8  CONN_025MM  [SCREWTERMINAL-5MM-2]
J9  CONN_025MM  [SCREWTERMINAL-5MM-2]
JP1  PINHD-2X20  [2X20]
JP2  PINHD-1X4  [1X04]
JP3  PINHD-1X4  [1X04]
R63  10k  R-US_R0603  [R0603]
R64  10k  R-US_R0603  [R0603]
S1  10-XX  [B3F-10XX]

### Nets
+5V: C115.1 JP1.2 ; also sheet 4,7
BL_PWM: JP1.7 R63.2 ; also sheet 10
DBG_RX: JP3.2 ; also sheet 10
DBG_TX: JP3.3 ; also sheet 10
GND: C114.1 C115.2 JP1.8 JP1.11 JP1.12 JP1.19 JP1.20 JP1.27 JP1.28 JP1.40 JP2.3 JP3.1 R63.1 S1.3(P) S1.4(P1) ; also sheet 1,2,3,4,7,8,9,10,11
LCD_B2: JP1.29 ; also sheet 10
LCD_B3: JP1.30 ; also sheet 10
LCD_B4: JP1.31 ; also sheet 10
LCD_B5: JP1.32 ; also sheet 10
LCD_B6: JP1.33 ; also sheet 10
LCD_B7: JP1.34 ; also sheet 10
LCD_CLK: JP1.35 ; also sheet 10
LCD_DE: JP1.39 ; also sheet 10
LCD_G2: JP1.21 ; also sheet 10
LCD_G3: JP1.22 ; also sheet 10
LCD_G4: JP1.23 ; also sheet 10
LCD_G5: JP1.24 ; also sheet 10
LCD_G6: JP1.25 ; also sheet 10
LCD_G7: JP1.26 ; also sheet 10
LCD_HSYNC: JP1.37 ; also sheet 10
LCD_R2: JP1.13 ; also sheet 10
LCD_R3: JP1.14 ; also sheet 10
LCD_R4: JP1.15 ; also sheet 10
LCD_R5: JP1.16 ; also sheet 10
LCD_R6: JP1.17 ; also sheet 10
LCD_R7: JP1.18 ; also sheet 10
LCD_VSYNC: JP1.36 ; also sheet 10
RESET: C114.2 R64.2 S1.1(S) S1.2(S1) ; also sheet 10
SPOUT_L_N: J8.2 ; also sheet 5
SPOUT_L_P: J8.1 ; also sheet 5
SPOUT_R_N: J9.2 ; also sheet 5
SPOUT_R_P: J9.1 ; also sheet 5
SWCLK: JP2.2 ; also sheet 10
SWDIO: JP2.4 ; also sheet 10
TOUCH_CS: JP1.6 ; also sheet 10
TOUCH_IRQ: JP1.1 ; also sheet 10
TOUCH_MISO: JP1.4 ; also sheet 10
TOUCH_MOSI: JP1.3 ; also sheet 10
TOUCH_SCK: JP1.5 ; also sheet 10
VDD: JP2.1 JP3.4 R64.1 ; also sheet 1,2,3,4,5,7,8,9,10,11
Unconnected: JP1.9 JP1.10 JP1.38

### Notes on the sheet
- LCD | DEBUG UART
- RESET SWITCH
- CORTEX-M7 DEBUG
- INTERNAL SPEAKERS
- LEFT
- RIGHT
- Internal Connectors and Reset

## Sheet 7 of 11: External IO Connectors Contains the connectors and supporting circuitry for the micro-SD, USB and MIDI ports
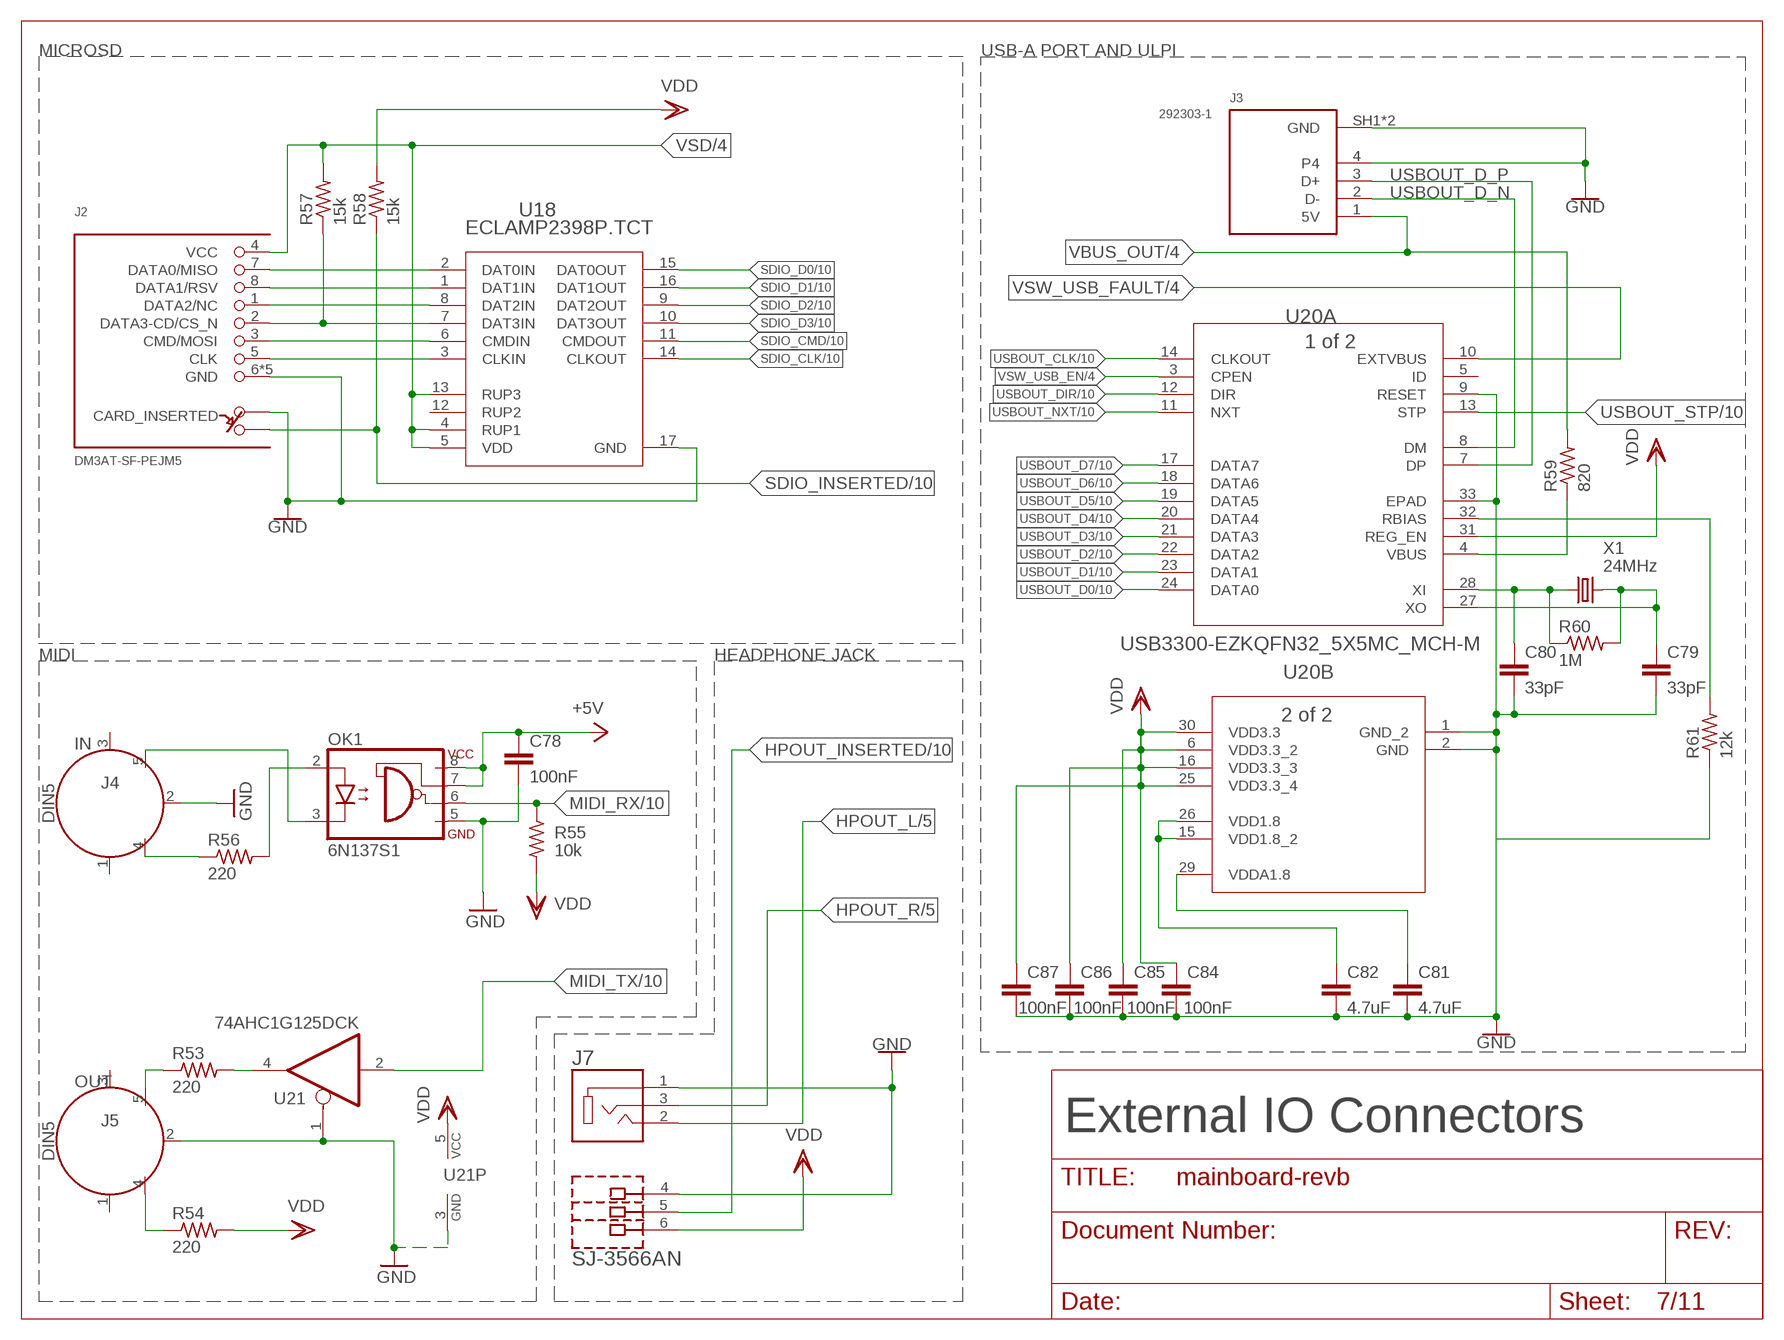
[diagram p6: schematic, sheet 7]

### Parts
C78  100nF  C-EUC0402  [C0402]
C79  33pF  C-EUC0402  [C0402]
C80  33pF  C-EUC0402  [C0402]
C81  4.7uF  C-EUC0402  [C0402]
C82  4.7uF  C-EUC0402  [C0402]
C84  100nF  C-EUC0402  [C0402]
C85  100nF  C-EUC0402  [C0402]
C86  100nF  C-EUC0402  [C0402]
C87  100nF  C-EUC0402  [C0402]
J2  DM3AT-SF-PEJM5  [DM3AT-SF-PEJM5]
J3  292303-1  [TE_292303-1]
J4  DIN5  [DIN5-RA-PTH]
J5  DIN5  [DIN5-RA-PTH]
J7  SJ-3566AN  [CUI_SJ-3566AN]
OK1  6N137S1  [SOP254P1030X390-8L]
R53  220  R-US_R0603  [R0603]
R54  220  R-US_R0603  [R0603]
R55  10k  R-US_R0603  [R0603]
R56  220  R-US_R0603  [R0603]
R57  15k  R-US_R0603  [R0603]
R58  15k  R-US_R0603  [R0603]
R59  820  R-US_R0603  [R0603]
R60  1M  R-US_R0603  [R0603]
R61  12k  R-US_R0603  [R0603]
U18  ECLAMP2398P.TCT  [SLP4014P16_SEM]
U20  USB3300-EZKQFN32_5X5MC_MCH-M  [QFN32_5X5MC_MCH-M]
U21  74AHC1G125DCK  [SC70-5]
X1  24MHz  CRYSTALHC49S  [HC49/S]

### Nets
+5V: C78.1 OK1.7(VE) OK1.8(VCC) ; also sheet 4,6
GND: C78.2 C79.2 C80.2 C81.2 C82.2 C84.2 C85.2 C86.2 C87.2 J2.6(GND) J2.A J2.MOUNT0(GND) J2.MOUNT1(GND) J2.MOUNT2(GND) J2.MOUNT3(GND) J3.4 J3.SH1(GND) J3.SH2(GND) J4.2 J5.2 J7.1 J7.4 OK1.5(GND) R61.1 U18.17(GND) U20.1(B:GND_2) U20.2(B:GND) U20.9(A:RESET) U20.33(A:EPAD) U21.1(OE) U21.3(GND) ; also sheet 1,2,3,4,6,8,9,10,11
HPOUT_INSERTED: J7.5 ; also sheet 10
HPOUT_L: J7.2 ; also sheet 5
HPOUT_R: J7.3 ; also sheet 5
MIDI_RX: OK1.6(VO) R55.1 ; also sheet 10
MIDI_TX: U21.2(I) ; also sheet 10
N$61: J5.5 R53.1
N$62: R53.2 U21.4(O)
N$63: J5.4 R54.1
N$64: OK1.2(A) R56.2
N$65: J4.4 R56.1
N$66: J4.5 OK1.3(C)
N$67: J2.7(DATA0/MISO) U18.2(DAT0IN)
N$68: J2.8(DATA1/RSV) U18.1(DAT1IN)
N$69: J2.1(DATA2/NC) U18.8(DAT2IN)
N$70: J2.2(DATA3-CD/CS_N) R57.1 U18.7(DAT3IN)
N$71: J2.3(CMD/MOSI) U18.6(CMDIN)
N$72: J2.5(CLK) U18.3(CLKIN)
N$73: R59.1 U20.4(A:VBUS)
N$74: C80.1 R60.1 U20.28(A:XI) X1.1
N$75: C79.1 R60.2 U20.27(A:XO) X1.2
N$76: R61.2 U20.32(A:RBIAS)
N$77: C82.1 U20.15(B:VDD1.8_2) U20.26(B:VDD1.8)
N$78: C81.1 U20.29(B:VDDA1.8)
SDIO_CLK: U18.14(CLKOUT) ; also sheet 10
SDIO_CMD: U18.11(CMDOUT) ; also sheet 10
SDIO_D0: U18.15(DAT0OUT) ; also sheet 10
SDIO_D1: U18.16(DAT1OUT) ; also sheet 10
SDIO_D2: U18.9(DAT2OUT) ; also sheet 10
SDIO_D3: U18.10(DAT3OUT) ; also sheet 10
SDIO_INSERTED: J2.B R58.1 ; also sheet 10
USBOUT_CLK: U20.14(A:CLKOUT) ; also sheet 10
USBOUT_D0: U20.24(A:DATA0) ; also sheet 10
USBOUT_D1: U20.23(A:DATA1) ; also sheet 10
USBOUT_D2: U20.22(A:DATA2) ; also sheet 10
USBOUT_D3: U20.21(A:DATA3) ; also sheet 10
USBOUT_D4: U20.20(A:DATA4) ; also sheet 10
USBOUT_D5: U20.19(A:DATA5) ; also sheet 10
USBOUT_D6: U20.18(A:DATA6) ; also sheet 10
USBOUT_D7: U20.17(A:DATA7) ; also sheet 10
USBOUT_D_N: J3.2(D-) U20.8(A:DM)
USBOUT_D_P: J3.3(D+) U20.7(A:DP)
USBOUT_DIR: U20.12(A:DIR) ; also sheet 10
USBOUT_NXT: U20.11(A:NXT) ; also sheet 10
USBOUT_STP: U20.13(A:STP) ; also sheet 10
VBUS_OUT: J3.1(5V) R59.2 ; also sheet 4
VDD: C84.1 C85.1 C86.1 C87.1 J7.6 R54.2 R55.2 R58.2 U20.6(B:VDD3.3_2) U20.16(B:VDD3.3_3) U20.25(B:VDD3.3_4) U20.30(B:VDD3.3) U20.31(A:REG_EN) U21.5(VCC) ; also sheet 1,2,3,4,5,6,8,9,10,11
VSD: J2.4(VCC) R57.2 U18.4(RUP1) U18.5(VDD) U18.13(RUP3) ; also sheet 4
VSW_USB_EN: U20.3(A:CPEN) ; also sheet 4
VSW_USB_FAULT: U20.10(A:EXTVBUS) ; also sheet 4
Unconnected: J4.1 J4.3 J5.1 J5.3 U18.12(RUP2) U20.5(A:ID)

### Notes on the sheet
- MICROSD | USB-A PORT AND ULPI
- MIDI | HEADPHONE JACK
- IN
- OUT
- External IO Connectors

## Sheet 8 of 11: Exposed Panel Interface Buttons, lights, knobs and sliders
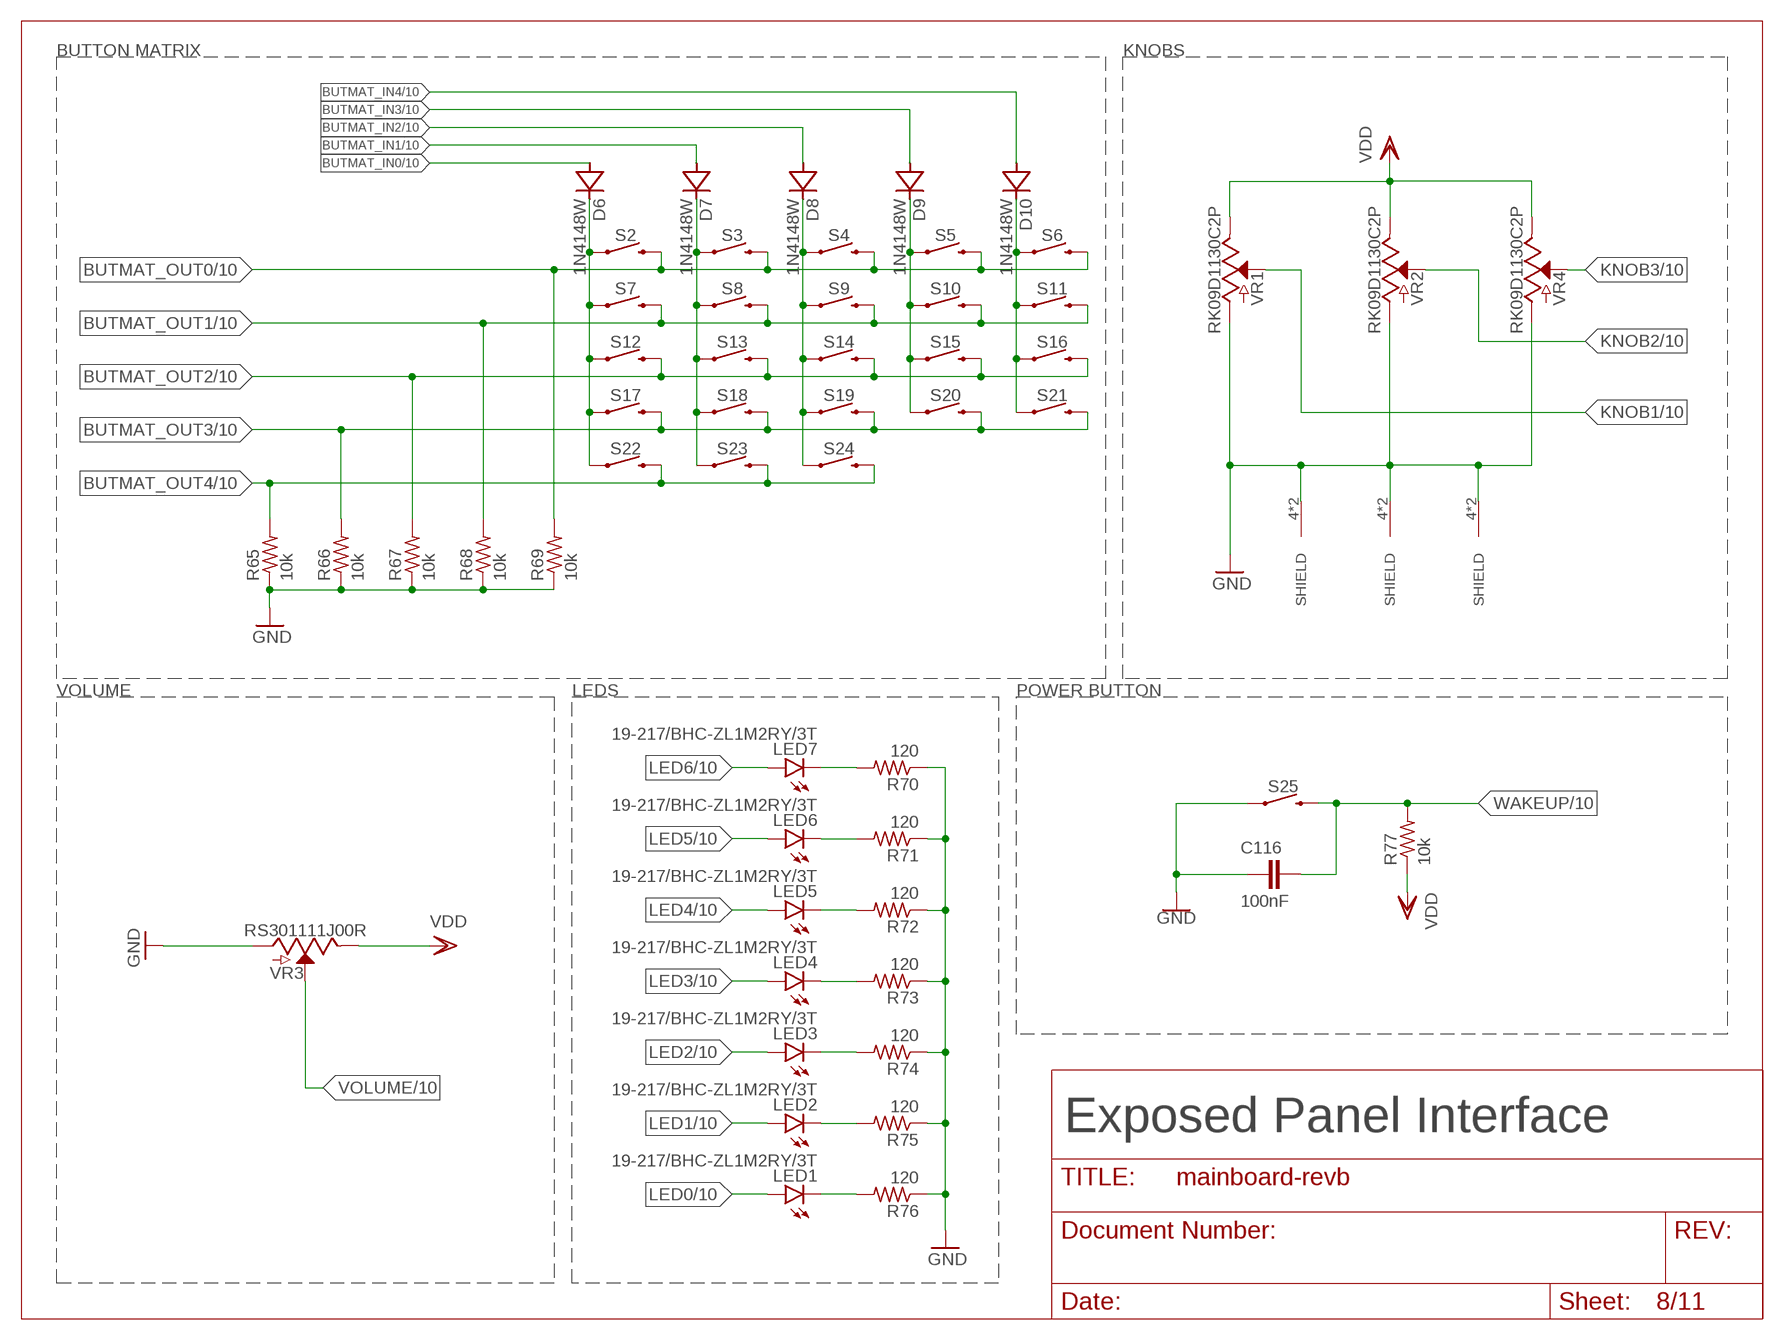
[diagram p7: schematic, sheet 8]

### Parts
C116  100nF  C-EUC0603  [C0603]
D6  1N4148W  [SOD123]
D7  1N4148W  [SOD123]
D8  1N4148W  [SOD123]
D9  1N4148W  [SOD123]
D10  1N4148W  [SOD123]
LED1  19-217/BHC-ZL1M2RY/3T  LEDCHIPLED_0603  [CHIPLED_0603]
LED2  19-217/BHC-ZL1M2RY/3T  LEDCHIPLED_0603  [CHIPLED_0603]
LED3  19-217/BHC-ZL1M2RY/3T  LEDCHIPLED_0603  [CHIPLED_0603]
LED4  19-217/BHC-ZL1M2RY/3T  LEDCHIPLED_0603  [CHIPLED_0603]
LED5  19-217/BHC-ZL1M2RY/3T  LEDCHIPLED_0603  [CHIPLED_0603]
LED6  19-217/BHC-ZL1M2RY/3T  LEDCHIPLED_0603  [CHIPLED_0603]
LED7  19-217/BHC-ZL1M2RY/3T  LEDCHIPLED_0603  [CHIPLED_0603]
R65  10k  R-US_R0603  [R0603]
R66  10k  R-US_R0603  [R0603]
R67  10k  R-US_R0603  [R0603]
R68  10k  R-US_R0603  [R0603]
R69  10k  R-US_R0603  [R0603]
R70  120  R-US_R0603  [R0603]
R71  120  R-US_R0603  [R0603]
R72  120  R-US_R0603  [R0603]
R73  120  R-US_R0603  [R0603]
R74  120  R-US_R0603  [R0603]
R75  120  R-US_R0603  [R0603]
R76  120  R-US_R0603  [R0603]
R77  10k  R-US_R0603  [R0603]
S2  B3F-1052  [TACTILE_SWITCH_PTH_6.0MM]
S3  B3F-1052  [TACTILE_SWITCH_PTH_6.0MM]
S4  B3F-1052  [TACTILE_SWITCH_PTH_6.0MM]
S5  B3F-1052  [TACTILE_SWITCH_PTH_6.0MM]
S6  B3F-1052  [TACTILE_SWITCH_PTH_6.0MM]
S7  B3F-1052  [TACTILE_SWITCH_PTH_6.0MM]
S8  B3F-1052  [TACTILE_SWITCH_PTH_6.0MM]
S9  B3F-1052  [TACTILE_SWITCH_PTH_6.0MM]
S10  B3F-1052  [TACTILE_SWITCH_PTH_6.0MM]
S11  B3F-1052  [TACTILE_SWITCH_PTH_6.0MM]
S12  B3F-1052  [TACTILE_SWITCH_PTH_6.0MM]
S13  B3F-1052  [TACTILE_SWITCH_PTH_6.0MM]
S14  B3F-1052  [TACTILE_SWITCH_PTH_6.0MM]
S15  B3F-1052  [TACTILE_SWITCH_PTH_6.0MM]
S16  B3F-1052  [TACTILE_SWITCH_PTH_6.0MM]
S17  B3F-1052  [TACTILE_SWITCH_PTH_6.0MM]
S18  B3F-1052  [TACTILE_SWITCH_PTH_6.0MM]
S19  B3F-1052  [TACTILE_SWITCH_PTH_6.0MM]
S20  B3F-1052  [TACTILE_SWITCH_PTH_6.0MM]
S21  B3F-1052  [TACTILE_SWITCH_PTH_6.0MM]
S22  B3F-1052  [TACTILE_SWITCH_PTH_6.0MM]
S23  B3F-1052  [TACTILE_SWITCH_PTH_6.0MM]
S24  B3F-1052  [TACTILE_SWITCH_PTH_6.0MM]
S25  B3F-1052  [TACTILE_SWITCH_PTH_6.0MM]
VR1  RK09D1130C2P  [RK09D1130C3C]
VR2  RK09D1130C2P  [RK09D1130C3C]
VR3  RS301111J00R  [RS301111J00R]
VR4  RK09D1130C2P  [RK09D1130C3C]

### Nets
BUTMAT_IN0: D6.A ; also sheet 10
BUTMAT_IN1: D7.A ; also sheet 10
BUTMAT_IN2: D8.A ; also sheet 10
BUTMAT_IN3: D9.A ; also sheet 10
BUTMAT_IN4: D10.A ; also sheet 10
BUTMAT_OUT0: R69.2 S2.3 S3.3 S4.3 S5.3 S6.3 ; also sheet 10
BUTMAT_OUT1: R68.2 S7.3 S8.3 S9.3 S10.3 S11.3 ; also sheet 10
BUTMAT_OUT2: R67.2 S12.3 S13.3 S14.3 S15.3 S16.3 ; also sheet 10
BUTMAT_OUT3: R66.2 S17.3 S18.3 S19.3 S20.3 S21.3 ; also sheet 10
BUTMAT_OUT4: R65.2 S22.3 S23.3 S24.3 ; also sheet 10
GND: C116.1 R65.1 R66.1 R67.1 R68.1 R69.1 R70.1 R71.1 R72.1 R73.1 R74.1 R75.1 R76.1 S25.1 VR1.1(A) VR1.4(SHIELD) VR1.5(SHIELD) VR2.1(A) VR2.4(SHIELD) VR2.5(SHIELD) VR3.1(A) VR4.1(A) VR4.4(SHIELD) VR4.5(SHIELD) ; also sheet 1,2,3,4,6,7,9,10,11
KNOB1: VR1.2(S) ; also sheet 10
KNOB2: VR2.2(S) ; also sheet 10
KNOB3: VR4.2(S) ; also sheet 10
LED0: LED1.A ; also sheet 10
LED1: LED2.A ; also sheet 10
LED2: LED3.A ; also sheet 10
LED3: LED4.A ; also sheet 10
LED4: LED5.A ; also sheet 10
LED5: LED6.A ; also sheet 10
LED6: LED7.A ; also sheet 10
N$41: D6.C S2.1 S7.1 S12.1 S17.1 S22.1
N$79: D7.C S3.1 S8.1 S13.1 S18.1 S23.1
N$80: D8.C S4.1 S9.1 S14.1 S19.1 S24.1
N$81: D9.C S5.1 S10.1 S15.1 S20.1
N$82: D10.C S6.1 S11.1 S16.1 S21.1
N$83: LED1.C R76.2
N$84: LED2.C R75.2
N$85: LED3.C R74.2
N$86: LED4.C R73.2
N$87: LED5.C R72.2
N$88: LED6.C R71.2
N$89: LED7.C R70.2
VDD: R77.1 VR1.3(E) VR2.3(E) VR3.3(E) VR4.3(E) ; also sheet 1,2,3,4,5,6,7,9,10,11
VOLUME: VR3.2(S) ; also sheet 10
WAKEUP: C116.2 R77.2 S25.3 ; also sheet 10

### Notes on the sheet
- BUTTON MATRIX | KNOBS
- VOLUME | LEDS | POWER BUTTON
- Exposed Panel Interface

## Sheet 9 of 11: External Processor Memories Contains SRAM, Flash and EEPROM
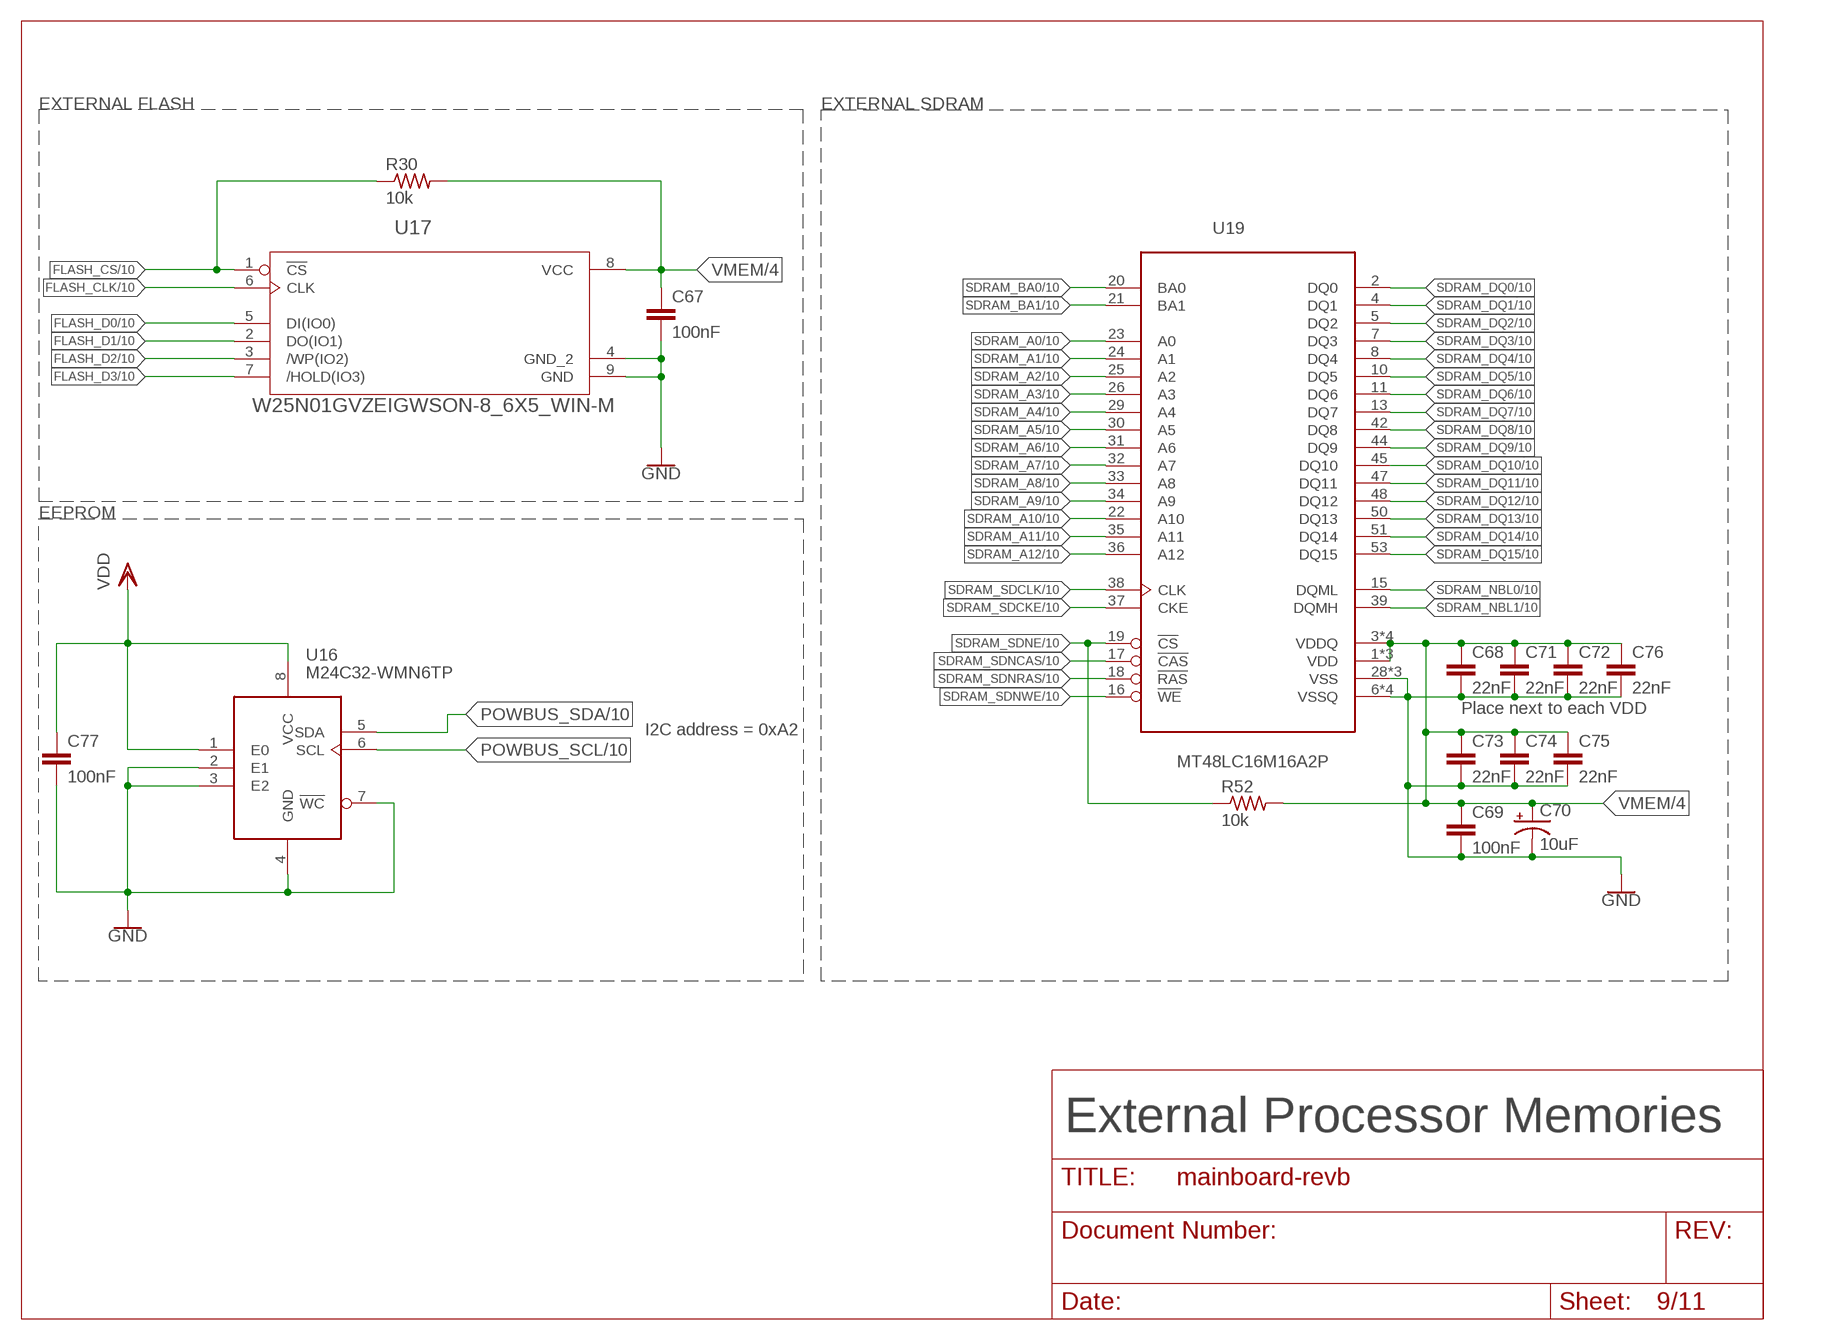
[diagram p8: schematic, sheet 9]

### Parts
C67  100nF  C-EUC0402  [C0402]
C68  22nF  C-EUC0402  [C0402]
C69  100nF  C-EUC0402  [C0402]
C70  10uF  CPOL-USSMCB  [SMC_B]
C71  22nF  C-EUC0402  [C0402]
C72  22nF  C-EUC0402  [C0402]
C73  22nF  C-EUC0402  [C0402]
C74  22nF  C-EUC0402  [C0402]
C75  22nF  C-EUC0402  [C0402]
C76  22nF  C-EUC0402  [C0402]
C77  100nF  C-EUC0402  [C0402]
R30  10k  R-US_R0402  [R0402]
R52  10k  R-US_R0402  [R0402]
U16  M24C32-WMN6TP  [SOIC127P600X175-8N]
U17  W25N01GVZEIGWSON-8_6X5_WIN-M  [WSON-8_6X5_WIN-M]
U19  MT48LC16M16A2P  [SOP80P1176X120-54N]

### Nets
FLASH_CLK: U17.6(CLK) ; also sheet 10
FLASH_CS: R30.1 U17.1(!CS) ; also sheet 10
FLASH_D0: U17.5(DI(IO0)) ; also sheet 10
FLASH_D1: U17.2(DO(IO1)) ; also sheet 10
FLASH_D2: U17.3(/WP(IO2)) ; also sheet 10
FLASH_D3: U17.7(/HOLD(IO3)) ; also sheet 10
GND: C67.2 C68.2 C69.2 C70.- C71.2 C72.2 C73.2 C74.2 C75.2 C76.2 C77.2 U16.2(E1) U16.3(E2) U16.4(GND) U16.7(!WC) U17.4(GND_2) U17.9(GND) U19.6(VSSQ) U19.12(VSSQ) U19.28(VSS) U19.41(VSS) U19.46(VSSQ) U19.52(VSSQ) U19.54(VSS) ; also sheet 1,2,3,4,6,7,8,10,11
POWBUS_SCL: U16.6(SCL) ; also sheet 1,2,3,10
POWBUS_SDA: U16.5(SDA) ; also sheet 1,2,3,10
SDRAM_A0: U19.23(A0) ; also sheet 10
SDRAM_A1: U19.24(A1) ; also sheet 10
SDRAM_A2: U19.25(A2) ; also sheet 10
SDRAM_A3: U19.26(A3) ; also sheet 10
SDRAM_A4: U19.29(A4) ; also sheet 10
SDRAM_A5: U19.30(A5) ; also sheet 10
SDRAM_A6: U19.31(A6) ; also sheet 10
SDRAM_A7: U19.32(A7) ; also sheet 10
SDRAM_A8: U19.33(A8) ; also sheet 10
SDRAM_A9: U19.34(A9) ; also sheet 10
SDRAM_A10: U19.22(A10) ; also sheet 10
SDRAM_A11: U19.35(A11) ; also sheet 10
SDRAM_A12: U19.36(A12) ; also sheet 10
SDRAM_BA0: U19.20(BA0) ; also sheet 10
SDRAM_BA1: U19.21(BA1) ; also sheet 10
SDRAM_DQ0: U19.2(DQ0) ; also sheet 10
SDRAM_DQ1: U19.4(DQ1) ; also sheet 10
SDRAM_DQ2: U19.5(DQ2) ; also sheet 10
SDRAM_DQ3: U19.7(DQ3) ; also sheet 10
SDRAM_DQ4: U19.8(DQ4) ; also sheet 10
SDRAM_DQ5: U19.10(DQ5) ; also sheet 10
SDRAM_DQ6: U19.11(DQ6) ; also sheet 10
SDRAM_DQ7: U19.13(DQ7) ; also sheet 10
SDRAM_DQ8: U19.42(DQ8) ; also sheet 10
SDRAM_DQ9: U19.44(DQ9) ; also sheet 10
SDRAM_DQ10: U19.45(DQ10) ; also sheet 10
SDRAM_DQ11: U19.47(DQ11) ; also sheet 10
SDRAM_DQ12: U19.48(DQ12) ; also sheet 10
SDRAM_DQ13: U19.50(DQ13) ; also sheet 10
SDRAM_DQ14: U19.51(DQ14) ; also sheet 10
SDRAM_DQ15: U19.53(DQ15) ; also sheet 10
SDRAM_NBL0: U19.15(DQML) ; also sheet 10
SDRAM_NBL1: U19.39(DQMH) ; also sheet 10
SDRAM_SDCKE: U19.37(CKE) ; also sheet 10
SDRAM_SDCLK: U19.38(CLK) ; also sheet 10
SDRAM_SDNCAS: U19.17(!CAS) ; also sheet 10
SDRAM_SDNE: R52.1 U19.19(!CS) ; also sheet 10
SDRAM_SDNRAS: U19.18(!RAS) ; also sheet 10
SDRAM_SDNWE: U19.16(!WE) ; also sheet 10
VDD: C77.1 U16.1(E0) U16.8(VCC) ; also sheet 1,2,3,4,5,6,7,8,10,11
VMEM: C67.1 C68.1 C69.1 C70.+ C71.1 C72.1 C73.1 C74.1 C75.1 C76.1 R30.2 R52.2 U17.8(VCC) U19.1(VDD) U19.3(VDDQ) U19.9(VDDQ) U19.14(VDD) U19.27(VDD) U19.43(VDDQ) U19.49(VDDQ) ; also sheet 4

### Notes on the sheet
- EXTERNAL FLASH | EXTERNAL SDRAM
- EEPROM
- Place next to each VDD
- I2C address = 0xA2
- External Processor Memories

## Sheet 10 of 11: STM32 (1/2) Contains the main processor and all the signals routed to it, plus the oscillator
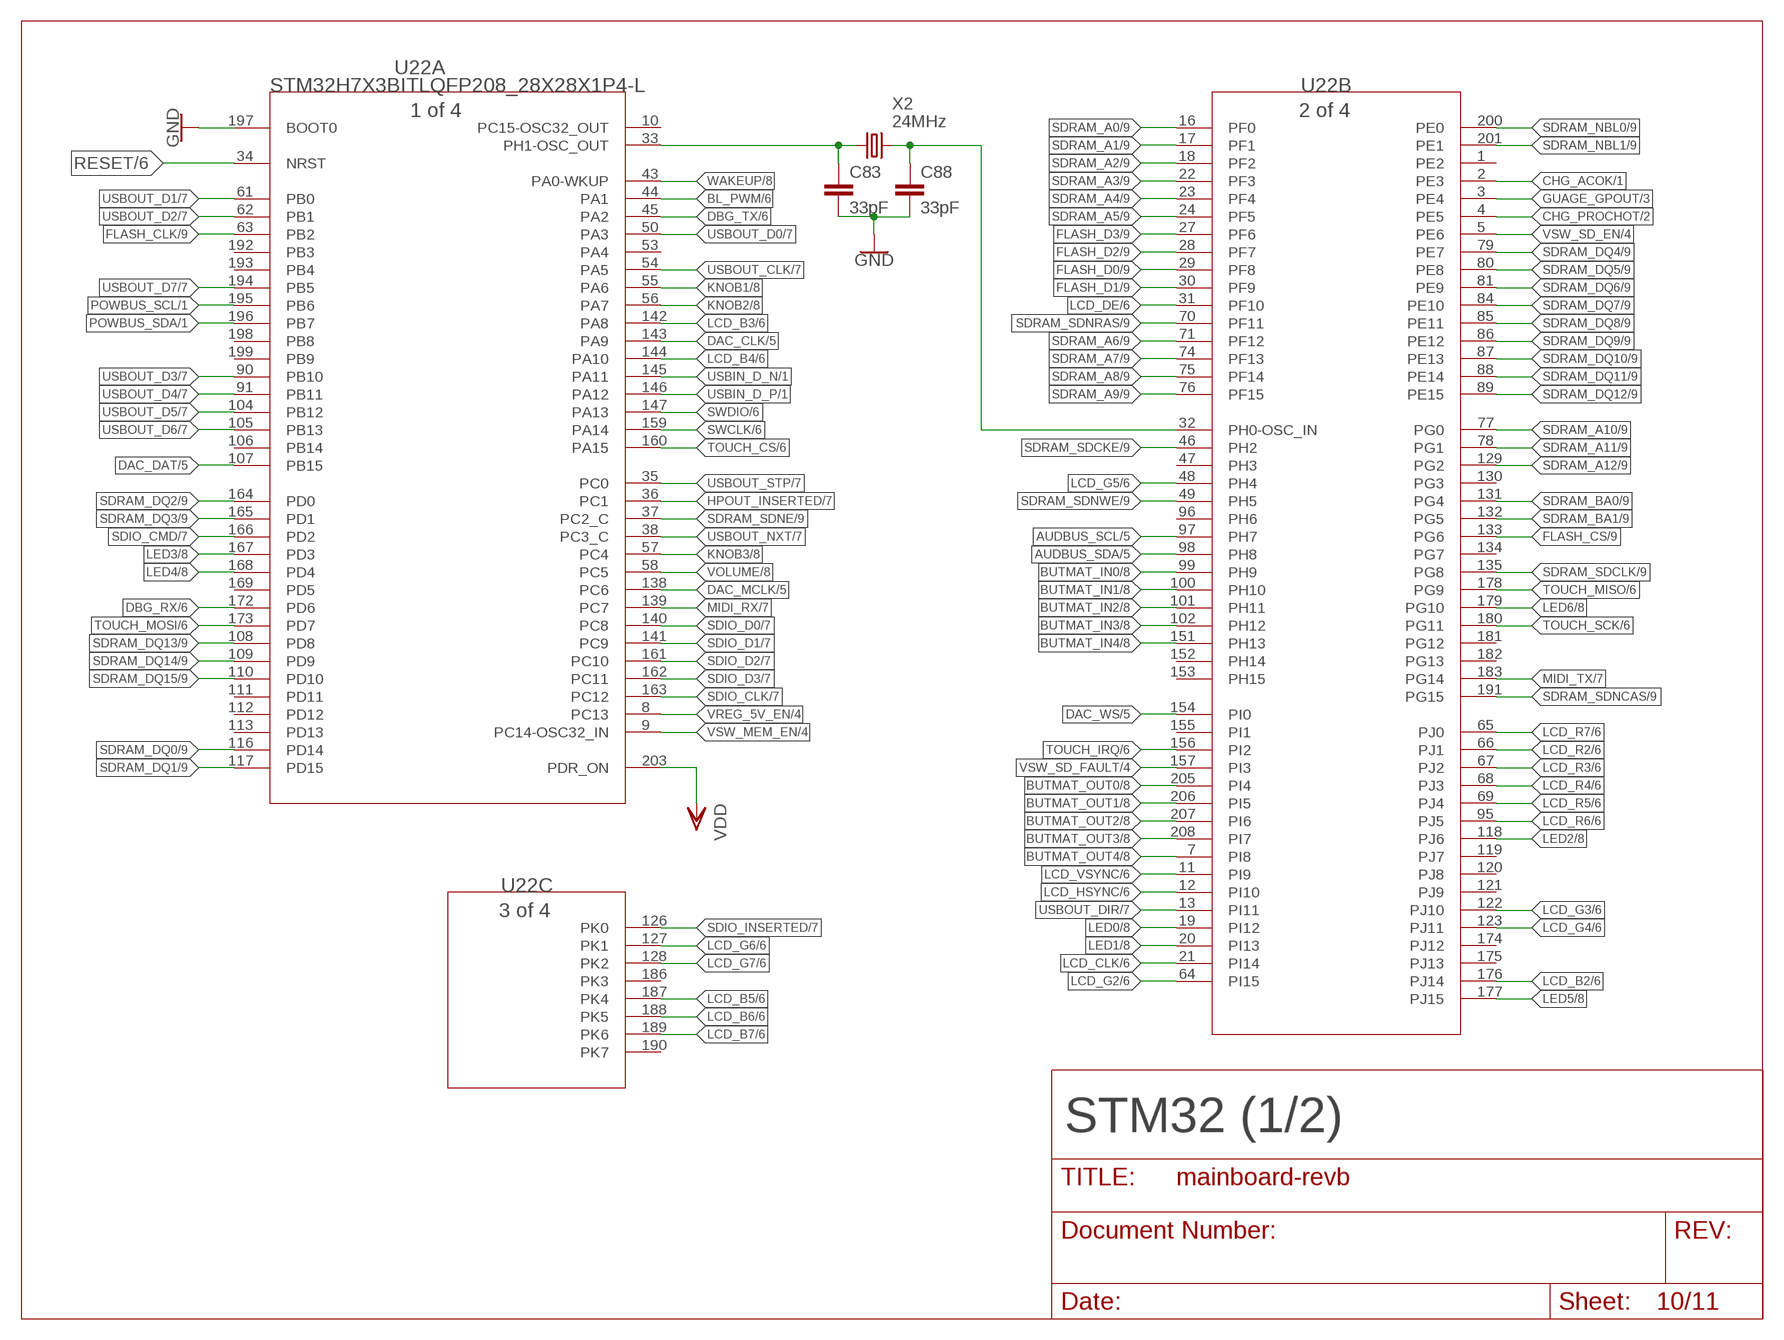
[diagram p9: schematic, sheet 10]

### Parts
C83  33pF  C-EUC0603  [C0603]
C88  33pF  C-EUC0603  [C0603]
U22  STM32H7X3BITLQFP208_28X28X1P4-L  [LQFP208_28X28X1P4-L]
X2  24MHz  CRYSTALHC49S  [HC49/S]

### Nets
AUDBUS_SCL: U22.97(B:PH7) ; also sheet 5
AUDBUS_SDA: U22.98(B:PH8) ; also sheet 5
BL_PWM: U22.44(A:PA1) ; also sheet 6
BUTMAT_IN0: U22.99(B:PH9) ; also sheet 8
BUTMAT_IN1: U22.100(B:PH10) ; also sheet 8
BUTMAT_IN2: U22.101(B:PH11) ; also sheet 8
BUTMAT_IN3: U22.102(B:PH12) ; also sheet 8
BUTMAT_IN4: U22.151(B:PH13) ; also sheet 8
BUTMAT_OUT0: U22.205(B:PI4) ; also sheet 8
BUTMAT_OUT1: U22.206(B:PI5) ; also sheet 8
BUTMAT_OUT2: U22.207(B:PI6) ; also sheet 8
BUTMAT_OUT3: U22.208(B:PI7) ; also sheet 8
BUTMAT_OUT4: U22.7(B:PI8) ; also sheet 8
CHG_ACOK: U22.2(B:PE3) ; also sheet 1,2
CHG_PROCHOT: U22.4(B:PE5) ; also sheet 2
DAC_CLK: U22.143(A:PA9) ; also sheet 5
DAC_DAT: U22.107(A:PB15) ; also sheet 5
DAC_MCLK: U22.138(A:PC6) ; also sheet 5
DAC_WS: U22.154(B:PI0) ; also sheet 5
DBG_RX: U22.172(A:PD6) ; also sheet 6
DBG_TX: U22.45(A:PA2) ; also sheet 6
FLASH_CLK: U22.63(A:PB2) ; also sheet 9
FLASH_CS: U22.133(B:PG6) ; also sheet 9
FLASH_D0: U22.29(B:PF8) ; also sheet 9
FLASH_D1: U22.30(B:PF9) ; also sheet 9
FLASH_D2: U22.28(B:PF7) ; also sheet 9
FLASH_D3: U22.27(B:PF6) ; also sheet 9
GND: C83.2 C88.2 U22.197(A:BOOT0) ; also sheet 1,2,3,4,6,7,8,9,11
GUAGE_GPOUT: U22.3(B:PE4) ; also sheet 3
HPOUT_INSERTED: U22.36(A:PC1) ; also sheet 7
KNOB1: U22.55(A:PA6) ; also sheet 8
KNOB2: U22.56(A:PA7) ; also sheet 8
KNOB3: U22.57(A:PC4) ; also sheet 8
LCD_B2: U22.176(B:PJ14) ; also sheet 6
LCD_B3: U22.142(A:PA8) ; also sheet 6
LCD_B4: U22.144(A:PA10) ; also sheet 6
LCD_B5: U22.187(C:PK4) ; also sheet 6
LCD_B6: U22.188(C:PK5) ; also sheet 6
LCD_B7: U22.189(C:PK6) ; also sheet 6
LCD_CLK: U22.21(B:PI14) ; also sheet 6
LCD_DE: U22.31(B:PF10) ; also sheet 6
LCD_G2: U22.64(B:PI15) ; also sheet 6
LCD_G3: U22.122(B:PJ10) ; also sheet 6
LCD_G4: U22.123(B:PJ11) ; also sheet 6
LCD_G5: U22.48(B:PH4) ; also sheet 6
LCD_G6: U22.127(C:PK1) ; also sheet 6
LCD_G7: U22.128(C:PK2) ; also sheet 6
LCD_HSYNC: U22.12(B:PI10) ; also sheet 6
LCD_R2: U22.66(B:PJ1) ; also sheet 6
LCD_R3: U22.67(B:PJ2) ; also sheet 6
LCD_R4: U22.68(B:PJ3) ; also sheet 6
LCD_R5: U22.69(B:PJ4) ; also sheet 6
LCD_R6: U22.95(B:PJ5) ; also sheet 6
LCD_R7: U22.65(B:PJ0) ; also sheet 6
LCD_VSYNC: U22.11(B:PI9) ; also sheet 6
LED0: U22.19(B:PI12) ; also sheet 8
LED1: U22.20(B:PI13) ; also sheet 8
LED2: U22.118(B:PJ6) ; also sheet 8
LED3: U22.167(A:PD3) ; also sheet 8
LED4: U22.168(A:PD4) ; also sheet 8
LED5: U22.177(B:PJ15) ; also sheet 8
LED6: U22.179(B:PG10) ; also sheet 8
MIDI_RX: U22.139(A:PC7) ; also sheet 7
MIDI_TX: U22.183(B:PG14) ; also sheet 7
N$90: C83.1 U22.33(A:PH1-OSC_OUT) X2.1
N$91: C88.1 U22.32(B:PH0-OSC_IN) X2.2
POWBUS_SCL: U22.195(A:PB6) ; also sheet 1,2,3,9
POWBUS_SDA: U22.196(A:PB7) ; also sheet 1,2,3,9
RESET: U22.34(A:NRST) ; also sheet 6
SDIO_CLK: U22.163(A:PC12) ; also sheet 7
SDIO_CMD: U22.166(A:PD2) ; also sheet 7
SDIO_D0: U22.140(A:PC8) ; also sheet 7
SDIO_D1: U22.141(A:PC9) ; also sheet 7
SDIO_D2: U22.161(A:PC10) ; also sheet 7
SDIO_D3: U22.162(A:PC11) ; also sheet 7
SDIO_INSERTED: U22.126(C:PK0) ; also sheet 7
SDRAM_A0: U22.16(B:PF0) ; also sheet 9
SDRAM_A1: U22.17(B:PF1) ; also sheet 9
SDRAM_A2: U22.18(B:PF2) ; also sheet 9
SDRAM_A3: U22.22(B:PF3) ; also sheet 9
SDRAM_A4: U22.23(B:PF4) ; also sheet 9
SDRAM_A5: U22.24(B:PF5) ; also sheet 9
SDRAM_A6: U22.71(B:PF12) ; also sheet 9
SDRAM_A7: U22.74(B:PF13) ; also sheet 9
SDRAM_A8: U22.75(B:PF14) ; also sheet 9
SDRAM_A9: U22.76(B:PF15) ; also sheet 9
SDRAM_A10: U22.77(B:PG0) ; also sheet 9
SDRAM_A11: U22.78(B:PG1) ; also sheet 9
SDRAM_A12: U22.129(B:PG2) ; also sheet 9
SDRAM_BA0: U22.131(B:PG4) ; also sheet 9
SDRAM_BA1: U22.132(B:PG5) ; also sheet 9
SDRAM_DQ0: U22.116(A:PD14) ; also sheet 9
SDRAM_DQ1: U22.117(A:PD15) ; also sheet 9
SDRAM_DQ2: U22.164(A:PD0) ; also sheet 9
SDRAM_DQ3: U22.165(A:PD1) ; also sheet 9
SDRAM_DQ4: U22.79(B:PE7) ; also sheet 9
SDRAM_DQ5: U22.80(B:PE8) ; also sheet 9
SDRAM_DQ6: U22.81(B:PE9) ; also sheet 9
SDRAM_DQ7: U22.84(B:PE10) ; also sheet 9
SDRAM_DQ8: U22.85(B:PE11) ; also sheet 9
SDRAM_DQ9: U22.86(B:PE12) ; also sheet 9
SDRAM_DQ10: U22.87(B:PE13) ; also sheet 9
SDRAM_DQ11: U22.88(B:PE14) ; also sheet 9
SDRAM_DQ12: U22.89(B:PE15) ; also sheet 9
SDRAM_DQ13: U22.108(A:PD8) ; also sheet 9
SDRAM_DQ14: U22.109(A:PD9) ; also sheet 9
SDRAM_DQ15: U22.110(A:PD10) ; also sheet 9
SDRAM_NBL0: U22.200(B:PE0) ; also sheet 9
SDRAM_NBL1: U22.201(B:PE1) ; also sheet 9
SDRAM_SDCKE: U22.46(B:PH2) ; also sheet 9
SDRAM_SDCLK: U22.135(B:PG8) ; also sheet 9
SDRAM_SDNCAS: U22.191(B:PG15) ; also sheet 9
SDRAM_SDNE: U22.37(A:PC2_C) ; also sheet 9
SDRAM_SDNRAS: U22.70(B:PF11) ; also sheet 9
SDRAM_SDNWE: U22.49(B:PH5) ; also sheet 9
SWCLK: U22.159(A:PA14) ; also sheet 6
SWDIO: U22.147(A:PA13) ; also sheet 6
TOUCH_CS: U22.160(A:PA15) ; also sheet 6
TOUCH_IRQ: U22.156(B:PI2) ; also sheet 6
TOUCH_MISO: U22.178(B:PG9) ; also sheet 6
TOUCH_MOSI: U22.173(A:PD7) ; also sheet 6
TOUCH_SCK: U22.180(B:PG11) ; also sheet 6
USBIN_D_N: U22.145(A:PA11) ; also sheet 1
USBIN_D_P: U22.146(A:PA12) ; also sheet 1
USBOUT_CLK: U22.54(A:PA5) ; also sheet 7
USBOUT_D0: U22.50(A:PA3) ; also sheet 7
USBOUT_D1: U22.61(A:PB0) ; also sheet 7
USBOUT_D2: U22.62(A:PB1) ; also sheet 7
USBOUT_D3: U22.90(A:PB10) ; also sheet 7
USBOUT_D4: U22.91(A:PB11) ; also sheet 7
USBOUT_D5: U22.104(A:PB12) ; also sheet 7
USBOUT_D6: U22.105(A:PB13) ; also sheet 7
USBOUT_D7: U22.194(A:PB5) ; also sheet 7
USBOUT_DIR: U22.13(B:PI11) ; also sheet 7
USBOUT_NXT: U22.38(A:PC3_C) ; also sheet 7
USBOUT_STP: U22.35(A:PC0) ; also sheet 7
VDD: U22.203(A:PDR_ON) ; also sheet 1,2,3,4,5,6,7,8,9,11
VOLUME: U22.58(A:PC5) ; also sheet 8
VREG_5V_EN: U22.8(A:PC13) ; also sheet 4
VSW_MEM_EN: U22.9(A:PC14-OSC32_IN) ; also sheet 4
VSW_SD_EN: U22.5(B:PE6) ; also sheet 4
VSW_SD_FAULT: U22.157(B:PI3) ; also sheet 4
WAKEUP: U22.43(A:PA0-WKUP) ; also sheet 8
Unconnected: U22.1(B:PE2) U22.10(A:PC15-OSC32_OUT) U22.47(B:PH3) U22.53(A:PA4) U22.96(B:PH6) U22.106(A:PB14) U22.111(A:PD11) U22.112(A:PD12) U22.113(A:PD13) U22.119(B:PJ7) U22.120(B:PJ8) U22.121(B:PJ9) U22.130(B:PG3) U22.134(B:PG7) U22.152(B:PH14) U22.153(B:PH15) U22.155(B:PI1) U22.169(A:PD5) U22.174(B:PJ12) U22.175(B:PJ13) U22.181(B:PG12) U22.182(B:PG13) U22.186(C:PK3) U22.190(C:PK7) U22.192(A:PB3) U22.193(A:PB4) U22.198(A:PB8) U22.199(A:PB9)

### Notes on the sheet
- STM32 (1/2)

## Sheet 11 of 11: STM32 (2/2) Contains the power for the STM32
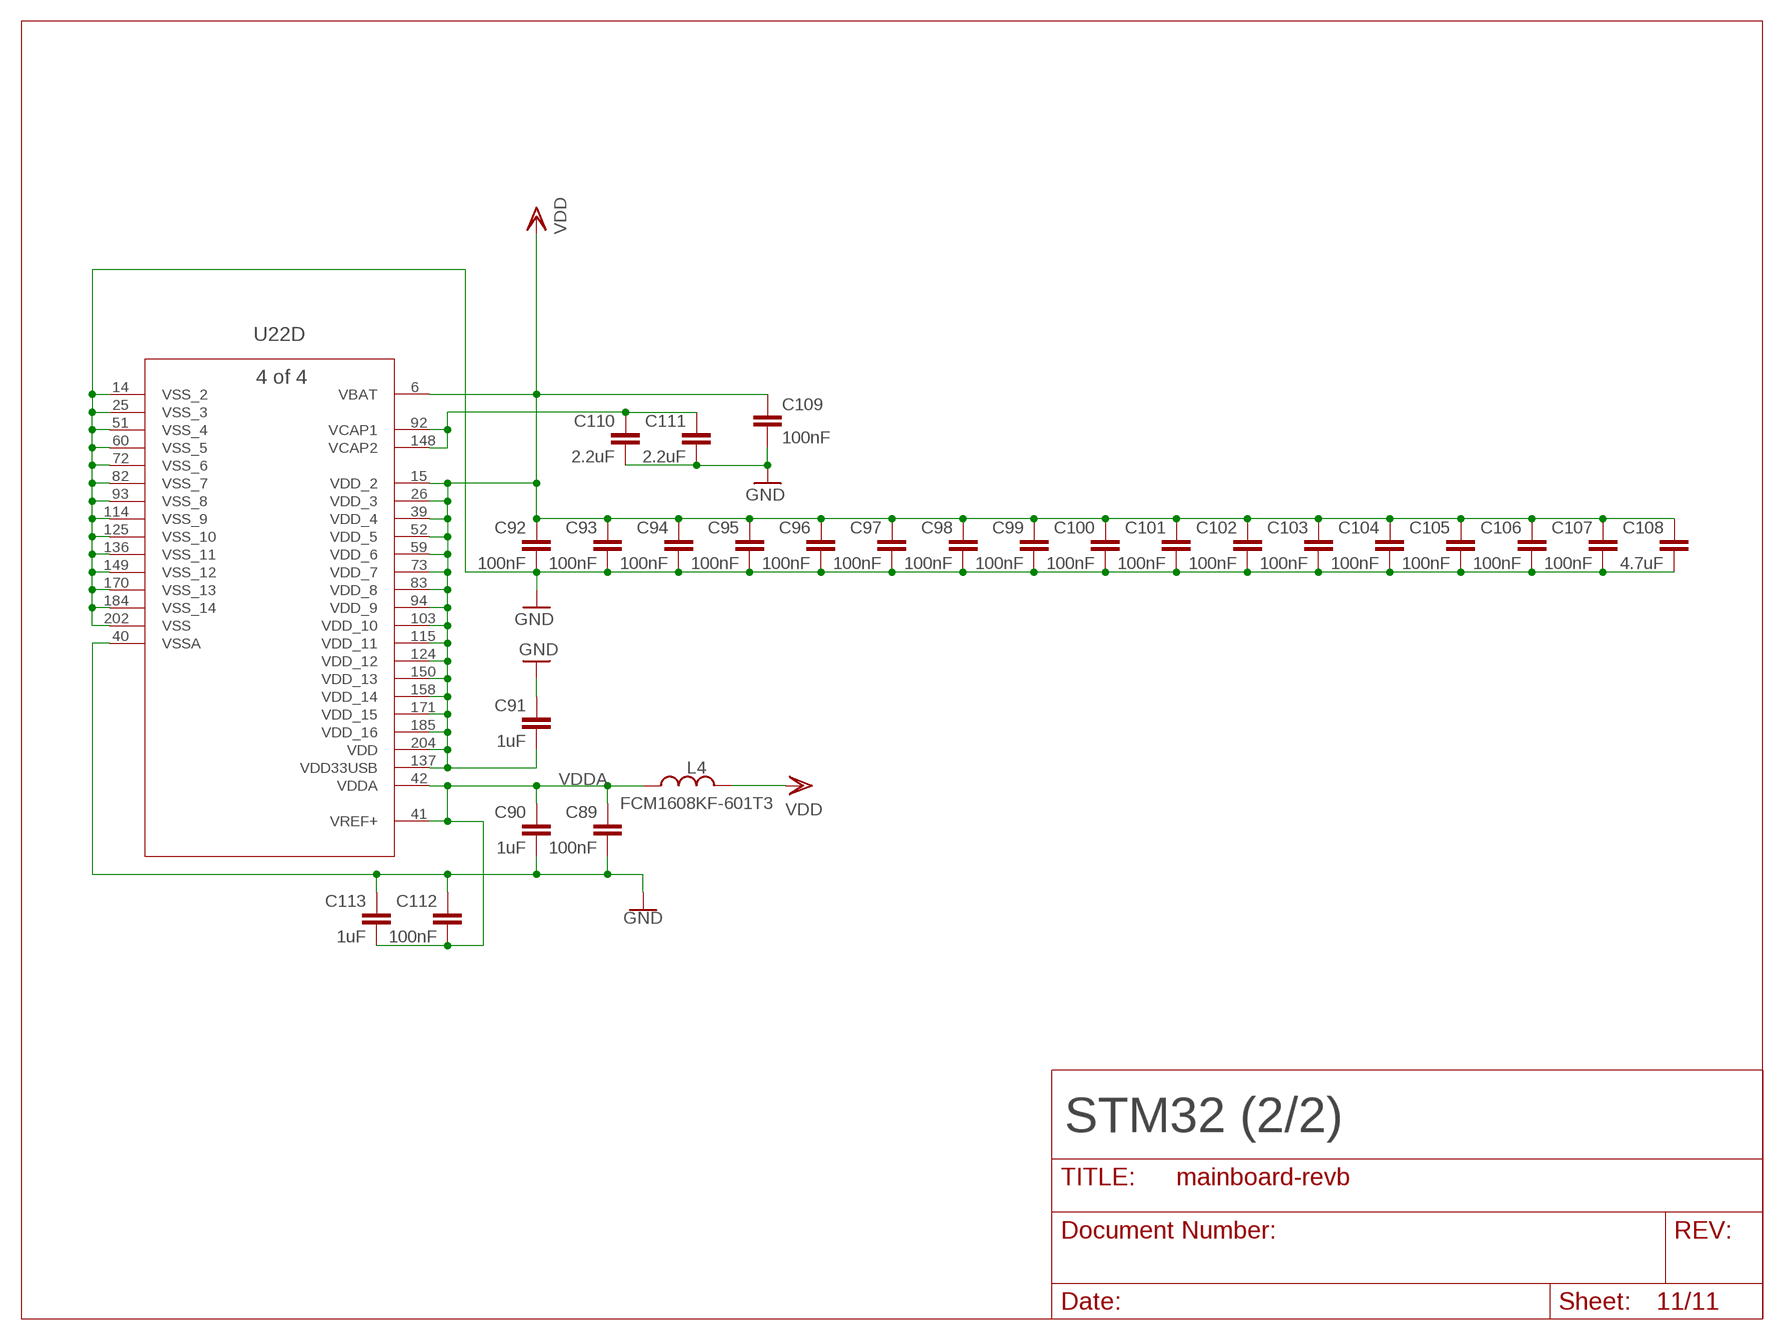
[diagram p10: schematic, sheet 11]

### Parts
C89  100nF  C-EUC0603  [C0603]
C90  1uF  C-EUC0603  [C0603]
C91  1uF  C-EUC0603  [C0603]
C92  100nF  C-EUC0603  [C0603]
C93  100nF  C-EUC0603  [C0603]
C94  100nF  C-EUC0603  [C0603]
C95  100nF  C-EUC0603  [C0603]
C96  100nF  C-EUC0603  [C0603]
C97  100nF  C-EUC0603  [C0603]
C98  100nF  C-EUC0603  [C0603]
C99  100nF  C-EUC0603  [C0603]
C100  100nF  C-EUC0603  [C0603]
C101  100nF  C-EUC0603  [C0603]
C102  100nF  C-EUC0603  [C0603]
C103  100nF  C-EUC0603  [C0603]
C104  100nF  C-EUC0603  [C0603]
C105  100nF  C-EUC0603  [C0603]
C106  100nF  C-EUC0603  [C0603]
C107  100nF  C-EUC0603  [C0603]
C108  4.7uF  C-EUC0603  [C0603]
C109  100nF  C-EUC0603  [C0603]
C110  2.2uF  C-EUC0603  [C0603]
C111  2.2uF  C-EUC0603  [C0603]
C112  100nF  C-EUC0603  [C0603]
C113  1uF  C-EUC0603  [C0603]
L4  FCM1608KF-601T3  L_CHIP-0603(1608-METRIC)  [INDC1608X95N]

### Nets
GND: C89.2 C90.2 C91.1 C92.2 C93.2 C94.2 C95.2 C96.2 C97.2 C98.2 C99.2 C100.2 C101.2 C102.2 C103.2 C104.2 C105.2 C106.2 C107.2 C108.2 C109.2 C110.2 C111.2 C112.1 C113.1 U22.14(D:VSS_2) U22.25(D:VSS_3) U22.40(D:VSSA) U22.51(D:VSS_4) U22.60(D:VSS_5) U22.72(D:VSS_6) U22.82(D:VSS_7) U22.93(D:VSS_8) U22.114(D:VSS_9) U22.125(D:VSS_10) U22.136(D:VSS_11) U22.149(D:VSS_12) U22.170(D:VSS_13) U22.184(D:VSS_14) U22.202(D:VSS) ; also sheet 1,2,3,4,6,7,8,9,10
N$92: C110.1 C111.1 U22.92(D:VCAP1) U22.148(D:VCAP2)
VDD: C91.2 C92.1 C93.1 C94.1 C95.1 C96.1 C97.1 C98.1 C99.1 C100.1 C101.1 C102.1 C103.1 C104.1 C105.1 C106.1 C107.1 C108.1 C109.1 L4.1 U22.6(D:VBAT) U22.15(D:VDD_2) U22.26(D:VDD_3) U22.39(D:VDD_4) U22.52(D:VDD_5) U22.59(D:VDD_6) U22.73(D:VDD_7) U22.83(D:VDD_8) U22.94(D:VDD_9) U22.103(D:VDD_10) U22.115(D:VDD_11) U22.124(D:VDD_12) U22.137(D:VDD33USB) U22.150(D:VDD_13) U22.158(D:VDD_14) U22.171(D:VDD_15) U22.185(D:VDD_16) U22.204(D:VDD) ; also sheet 1,2,3,4,5,6,7,8,9,10
VDDA: C89.1 C90.1 C112.2 C113.2 L4.2 U22.41(D:VREF+) U22.42(D:VDDA)

### Notes on the sheet
- STM32 (2/2)

## Library data of the parts
C1-C29 C31-C47 C49-C59 C61 C62 C64-C69 C71-C116 = rcl:C-EU: CAPACITOR, European symbol; SPICEPREFIX: C
C30 C48 C60 C63 C70 = rcl:CPOL-US: POLARIZED CAPACITOR, American symbol; SPICEPREFIX: C
D1 D2 = diode:BAS70: Silicon Schottky Diodes General-purpose diode for high-speed switching
D3 D4 = msynth:ESDAL
D5 = diode:SMF5.0AT1: 200 W Transient Voltage Suppressor Source: Data sheet <http://www.onsemi.com/pub_link/Collateral/SMF5.0AT1-D.PDF>
D6-D10 = msynth:1N4148W
J1 = 105450-0101:105450-0101: USB Shielded I/O Receptacle; Type C; Right Angle; Surface Mount; Gold over Nickel; ARROW_EUROPE-PURCHASE-URL: https://snapeda.com/shop?store=Arrow+Europe&id=448528; DESCRIPTION: USB-C (USB TYPE-C) USB 3.2 Gen 2 (USB 3.1 Gen 2, Superspeed + (USB 3.1)) Receptacle Connector 24 Position Surface Mount, Right Angle; Through Hole; DIGI-KEY_PART_NUMBER: WM12856CT-ND; DIGIKEY-PURCHASE-URL: https://snapeda.com/shop?store=DigiKey&id=448528; MF: Molex; MP: 1054500101; PACKAGE: None
J2 = msynth:DM3AT-SF-PEJM5: CONN MICRO SD R/A PUSH-PUSH SMD; DESCRIPTION: CONN MICRO SD CARD PUSH-PUSH R/A; DIGIKEY: HR1964CT-ND; MANUFACTURER: Hirose Electric Co Ltd; MPN: DM3AT-SF-PEJM5
J3 = msynth:292303-1: CONN USB RECEPT R/A TYPE A 4POS; AVAILABILITY: Unavailable; CENTERLINE_PITCH: 2 mm[.078 in]; COMMENT: 292303-1; DESCRIPTION: Conn; Data; USB; Recept; 2.0; 4 Pos; 1 Port; Rt Angle; A Ser; Tin over Copper; EU_ROHS_COMPLIANCE: Compliant; MF: TE Connectivity; MP: 292303-1; NUMBER_OF_POSITIONS: 4; PACKAGE: None; PRICE: None; PRODUCT_TYPE: Connector; TE_PURCHASE_URL: https://www.te.com/usa-en/product-292303-1.html?te_bu=Cor&te_type=disp&te_campaign=seda_glo_cor-seda-global-disp-prtnr-fy19-seda-model-bom-cta_sma-317_1&elqCampaignId=32493
J4 J5 = msynth:DIN5: DIN5 Connector - Female Right Angle (frequently used as a MIDI Jack connector) This type of connector and cable is frequently used for transmitting midi data (musical instrument digital interface). It is what you usually see on a keyboard or set of electronic drums. Learn more here <https://en.wikipedia.org/wiki/MIDI>. For more information on the pinout and electrical specifications of MIDI communications, please see the following resource: https://www.midi.org/specifications/item/midi-din-electrical-specification Here is the connector we sell at SparkFun: MIDI Connector - Female Right Angle <https://www.sparkfun.com/products/9536> (PRT-09536) Datasheet <hhttp://www.sparkfun.com/datasheets/Prototyping/Connectors/MIDI-RA.pdf> It is used on this SparkFun product: SparkFun MIDI Shield <https://www.sparkfun.com/products/12898> (DEV-12898); PROD_ID: CONN-09481
J6 = Rembrandt Electronics - JST XH Connectors v1-0:JST-XH-03-PIN: JST XH Connector 2 Pin Wire to board connector. Pitch: 2,54 mm, (0.100") Number of pins: 3 Created by Rembrandt Electronics www.rembrandtelectronics.com
J7 = SJ-3566AN:SJ-3566AN: Audio Jack Connector 3.5 mm Right-Angle Stereo Jack w/ SPDT Switch Check prices <https://snapeda.com/parts/SJ-3566AN/CUI%20Devices/view-part/?ref=eda>; ARROW_ELECTRONICS-PURCHASE-URL: https://snapeda.com/shop?store=Arrow+Electronics&id=452523; AVAILABILITY: Good; CUI_PURCHASE_URL: https://www.cuidevices.com/product/interconnect/connectors/audio-connectors/jacks/sj-356xn-series?utm_source=snapeda.com&utm_medium=referral&utm_campaign=snapedaBOM; DESCRIPTION: 3.5 mm, Stereo, Right Angle, Through Hole, SPDT Switch, Audio Jack Connector; DIGIKEY-PURCHASE-URL: https://snapeda.com/shop?store=DigiKey&id=452523; MF: CUI Devices; MOUSER-PURCHASE-URL: https://snapeda.com/shop?store=Mouser&id=452523; MP: SJ-3566AN; PACKAGE: None; PRICE: None
J8 J9 = SparkFun-Connectors:CONN_02: Multi connection point. Often used as Generic Header-pin footprint for 0.1 inch spaced/style header connections On any of the 0.1 inch spaced packages, you can populate with these: Break Away Headers - Straight <https://www.sparkfun.com/products/116> (PRT-00116) Break Away Male Headers - Right Angle <https://www.sparkfun.com/products/553> (PRT-00553) Female Headers <https://www.sparkfun.com/products/115> (PRT-00115) Break Away Headers - Machine Pin <https://www.sparkfun.com/products/117> (PRT-00117) Break Away Female Headers - Swiss Machine Pin <https://www.sparkfun.com/products/743> (PRT-00743) For SCREWTERMINALS and SPRING TERMINALS visit here: Screw Terimnals on SparkFun.com <https://www.sparkfun.com/search/results?term=Screw+Terminals> (5mm/3.5mm/2.54mm spacing) This device is also useful as a general connection point to wire up your design to another part of your project. Our various solder wires solder well into these plated through hole pads. Hook-Up Wire - Assortment (Stranded, 22 AWG) <https://www.sparkfun.com/products/11375> (PRT-11375) Hook-Up Wire - Assortment (Solid Core, 22 AWG) <https://www.sparkfun.com/products/11367> (PRT-11367) View the entire wire category on our website here <https://www.sparkfun.com/categories/141> Special notes: Molex polarized connector foot print use with: PRT-08233 with associated crimp pins and housings. 2.54_SCREWTERM for use with PRT-10571. 3.5mm Screw Terminal footprints for PRT-08084 5mm Screw Terminal footprints for use with PRT-08432; SF_SKU: PRT-08432
JP1 = pinhead:PINHD-2X20: PIN HEADER
JP2 JP3 = pinhead:PINHD-1X4: PIN HEADER
L1 = msynth:SPM6530T
L2 L3 = Inductor:L: Inductor Fixed - Generic; CATEGORY: Inductor; MPN: SPM4030T-2R2M; SUB-CATEGORY: Fixed
L4 = Inductor:L: Inductor Fixed - Generic; CATEGORY: Inductor; MPN: FCM1608KF-601T3; SUB-CATEGORY: Fixed
LED1-LED7 = led:LED: LED OSRAM: - CHIPLED LG R971, LG N971, LY N971, LG Q971, LY Q971, LO R971, LY R971 LH N974, LH R974 LS Q976, LO Q976, LY Q976 LO Q996 - Hyper CHIPLED LW Q18S LB Q993, LB Q99A, LB R99A - SideLED LS A670, LO A670, LY A670, LG A670, LP A670 LB A673, LV A673, LT A673, LW A673 LH A674 LY A675 LS A676, LA A676, LO A676, LY A676, LW A676 LS A679, LY A679, LG A679 - Hyper Micro SIDELED® LS Y876, LA Y876, LO Y876, LY Y876 LT Y87S - SmartLED LW L88C, LW L88S LB L89C, LB L89S, LG L890 LS L89K, LO L89K, LY L89K LS L896, LA L896, LO L896, LY L896 - TOPLED LS T670, LO T670, LY T670, LG T670, LP T670 LSG T670, LSP T670, LSY T670, LOP T670, LYG T670 LG T671, LOG T671, LSG T671 LB T673, LV T673, LT T673, LW T673 LH T674 LS T676, LA T676, LO T676, LY T676, LB T676, LH T676, LSB T676, LW T676 LB T67C, LV T67C, LT T67C, LS T67K, LO T67K, LY T67K, LW E67C LS E67B, LA E67B, LO E67B, LY E67B, LB E67C, LV E67C, LT E67C LW T67C LS T679, LY T679, LG T679 LS T770, LO T770, LY T770, LG T770, LP T770 LB T773, LV T773, LT T773, LW T773 LH T774 LS E675, LA E675, LY E675, LS T675 LS T776, LA T776, LO T776, LY T776, LB T776 LHGB T686 LT T68C, LB T68C - Hyper Mini TOPLED® LB M676 - Mini TOPLED Santana® LG M470 LS M47K, LO M47K, LY M47K Source: http://www.osram.convergy.de LUXEON: - LUMILED® LXK2-PW12-R00, LXK2-PW12-S00, LXK2-PW14-U00, LXK2-PW14-V00 LXK2-PM12-R00, LXK2-PM12-S00, LXK2-PM14-U00 LXK2-PE12-Q00, LXK2-PE12-R00, LXK2-PE12-S00, LXK2-PE14-T00, LXK2-PE14-U00 LXK2-PB12-K00, LXK2-PB12-L00, LXK2-PB12-M00, LXK2-PB14-N00, LXK2-PB14-P00, LXK2-PB14-Q00 LXK2-PR12-L00, LXK2-PR12-M00, LXK2-PR14-Q00, LXK2-PR14-R00 LXK2-PD12-Q00, LXK2-PD12-R00, LXK2-PD12-S00 LXK2-PH12-R00, LXK2-PH12-S00 LXK2-PL12-P00, LXK2-PL12-Q00, LXK2-PL12-R00 Source: www.luxeon.com KINGBRIGHT: KA-3528ASYC Source: www.kingbright.com
OK1 = msynth:6N137: MOTOROLA OPTO COUPLER
Q1 Q2 Q4 Q5 = msynth:DMG4496SSS-13
Q3 Q6 = msynth:AO4407A
R1-R61 R63-R77 = rcl:R-US_: RESISTOR, American symbol; SPICEPREFIX: R
S1 = switch-omron:10-XX: OMRON SWITCH; MPN: B3F-1000; OC_FARNELL: 176432; OC_NEWARK: 36M3542
S2-S25 = msynth:B3F-1052
SUPPLY1 = SparkFun-PowerSymbols:2PT_GND_TIE: Dual Ground Supply Power supply symbol for connecting two grounds. SparkFun Products: SparkFun AutoDriver - Stepper Motor Driver <https://www.sparkfun.com/products/11611>
TP1-TP13 = SparkFun-Connectors:TEST-POINT: SparkFun Test Points Bare copper test points for troubleshooting or In-Circuit-Testing. These are used by our Production team for verifying production board runs using pogo-pins on test beds. SparkFun Products: SparkFun LSM9DS1 Breakout <https://www.sparkfun.com/products/13284> SparkFun PSOC <https://www.sparkfun.com/products/13714> SparkFun Load Cell Amplifier <https://www.sparkfun.com/products/13879>
U1 = msynth:BQ24773RUYR; ALTERNATE_PARTNUMBER: BQ24773RUYT; APPLICATION_BUILDNUMBER: *; COMPTYPE: IC; MANUFACTURER: Texas Instruments; MOUNTTYPE: SMT; PACKAGEREFERENCE: RUY0028A; PARTNUMBER: BQ24773RUYR; PIN_COUNT: 29; REFDES: RefDes; ROHS: Y; TYPE: TYPE
U2 = msynth:LD39150DT33-R; BUILT_BY: EMA_Matt; DATASHEET: https://datasheet.octopart.com/LD39150DT33-R-STMicroelectronics-datasheet-8101330.pdf; MANUFACTURER_PART_NUMBER: LD39150DT33-R; SOURCELIBRARY: STMicroelectronics_2020-03-16; VENDOR: STMicroelectronics
U3 = msynth:BQ27510DRZR-G3; BUILT_BY: EMA_UL_Team; MANUFACTURER: Texas Instruments; MANUFACTURER_PART_NUMBER: BQ27510DRZR-G3; SOURCELIBRARY: TI_2016-05-20; VENDOR: Texas Instruments
U4 U5 = msynth:PAM2401SCADJ; BUILT_BY: EMA_UL_Team; MANUFACTURER_PART_NUMBER: PAM2401SCADJ; SOURCELIBRARY: DIODESINC_2_2015-08-18; VENDOR: Diodes Inc
U6 U7 = msynth:STMPS2151
U8 = msynth:STUSB4500QTR; BUILT_BY: EMA_Cory; COPYRIGHT: Copyright (C) 2018 Accelerated Designs. All rights reserved; DATASHEET: https://www.st.com/resource/en/datasheet/stusb4500.pdf; MANUFACTURER_PART_NUMBER: STUSB4500QTR; SOURCELIBRARY: STMicroelectonics_2020-02-13; VENDOR: STMicroelectronics
U9 = msynth:TCA4311ADGKR; DATASHEET_URL: http://www.ti.com/lit/gpn/TCA4311A; DESCRIPTION: Hot Swappable 2-Wire Bus Buffers*; FAMILY_NAME: I2C HUB, BUFFER, REPEATER; GENERIC_PART_NUMBER: TCA4311A; INDUSTRY_STD_PKG_TYPE: MSOP; MANUFACTURER: Texas Instruments; MANUFACTURER_PART_NUMBER: TCA4311ADGKR; PACKAGE_DESIGNATOR: DGK; PIN_COUNT: 8; VENDOR: Texas Instruments
U10 = msynth:TPS22929DDBVR; DATASHEET_URL: http://www.ti.com/lit/gpn/TPS22929D; DESCRIPTION: Low Input Voltage, 1.8A Single Channel Load Switch with Controlled Turn-On; FAMILY_NAME: NON CURRENT LIMITED LOAD SWITCH; GENERIC_PART_NUMBER: TPS22929D; INDUSTRY_STD_PKG_TYPE: SOT-23; MANUFACTURER: Texas Instruments; MANUFACTURER_PART_NUMBER: TPS22929DDBVR; PACKAGE_DESIGNATOR: DBV; PIN_COUNT: 6; VENDOR: Texas Instruments
U11 = msynth:AD5242BRUZ10; BUILT_BY: EMA_UL_Team; MANUFACTURER_PART_NUMBER: AD5242BRUZ10; SOURCELIBRARY: Analog_2012-01-01_2; VENDOR: Analog Devices Inc
U12 U13 = msynth:TPA4861DR; BUILT_BY: EMA_UL_Team; MANUFACTURER: Texas Instruments; MANUFACTURER_PART_NUMBER: TPA4861DR; SOURCELIBRARY: TI_2014-06-19; VENDOR: Texas Instruments
U14 = msynth:TPA6130A2RTJR; BUILT_BY: EMA_UL_Team; MANUFACTURER: Texas Instruments; MANUFACTURER_PART_NUMBER: TPA6130A2RTJR; VENDOR: Texas Instruments
U15 = msynth:CS4344-CZZR; BUILT_BY: EMA_UL_Team; MANUFACTURER_PART_NUMBER: CS4344-CZZR; SOURCELIBRARY: CIRRUSLOGIC_2014-09-10; VENDOR: Cirrus Logic
U16 = msynth:M24
U17 = msynth:W25N01GVZEIG; BUILT_BY: EMA_Cory; COPYRIGHT: Copyright (C) 2018 Accelerated Designs. All rights reserved; DATASHEET: https://www.winbond.com/resource-files/w25n01gv%20revl%20050918%20unsecured.pdf; MANUFACTURER_PART_NUMBER: W25N01GVZEIG; SOURCELIBRARY: Winbond_2020-02-06; VENDOR: Winbond
U18 = msynth:ECLAMP2398P.TCT; BUILT_BY: EMA_Cory; COPYRIGHT: Copyright (C) 2018 Accelerated Designs. All rights reserved; MANUFACTURER_PART_NUMBER: ECLAMP2398P.TCT; SOURCELIBRARY: Semtech_2020-01-22; VENDOR: Semtech Corporation
U19 = msynth:MT48LC16M16A2P
U20 = msynth:USB3300-EZK; BUILT_BY: EMA_Jessica; COPYRIGHT: Copyright (C) 2018 Accelerated Designs. All rights reserved; MANUFACTURER_PART_NUMBER: USB3300-EZK; SOURCELIBRARY: Microchip_2019-08-23_14; VENDOR: Microchip
U21 = 74xx-little-us:74*1G125: Single Bus Buffer Gate with 3-State Output
U22 = msynth:STM32H7X3BIT; COPYRIGHT: Copyright (C) 2016 Accelerated Designs. All rights reserved; MANUFACTURER_PART_NUMBER: STM32H7X3BIT; VENDOR: STMicroelectronics
VR1 VR2 VR4 = msynth:RK09D1130C2P: Alps Electric 1 Gang Rotary Potentiometer with a 6 mm Dia. Shaft, 10k, +/-20%, 0.05W, Linear RK09D1130C2P Source: Datasheet <https://www.alps.com/prod/info/E/HTML/Potentiometer/RotaryPotentiometers/RK09K/RK09D1130C2P.html>; ALLIED_NUMBER: R1075936; ALLIED_PRICE-STOCK: https://www.alliedelec.com/alps-rk09d1130c2p/R1075936/; DESCRIPTION: Alps Electric 1 Gang Rotary Potentiometer with a 6 mm Dia. Shaft, 10k, +/-20%, 0.05W, Linear RK09D1130C2P; HEIGHT: mm; MANUFACTURER_NAME: ALPS; MANUFACTURER_PART_NUMBER: RK09D1130C2P; MOUSER_PART_NUMBER: 688-RK09D1130C2P; MOUSER_PRICE-STOCK: https://www.mouser.com/Search/Refine.aspx?Keyword=688-RK09D1130C2P; RS_PART_NUMBER: 1726272; RS_PRICE-STOCK: http://uk.rs-online.com/web/p/products/1726272
VR3 = msynth:RS301111J00R: Slide Potentiometers 50 KOhms Source: Datasheet <https://datasheet.lcsc.com/szlcsc/1901091012_ALPS-Electric-RS301111J00R_C361172.pdf>; DESCRIPTION: Slide Potentiometers 50 KOhms; HEIGHT: 12.6mm; LCSC_PART_NUMBER: C361172; LCSC_PRICE-STOCK: https://lcsc.com/product-detail/Others_ALPS-Electric-RS301111J00R_C361172.html; MANUFACTURER_NAME: ALPS; MANUFACTURER_PART_NUMBER: RS301111J00R
X1 X2 = crystal:CRYSTAL: CRYSTAL; OC_FARNELL: 1667008; OC_NEWARK: unknown